# EAGLE design Shruthi-Digital-XT-v02 (EAGLE 5.09)

## Sheet 1 of 3
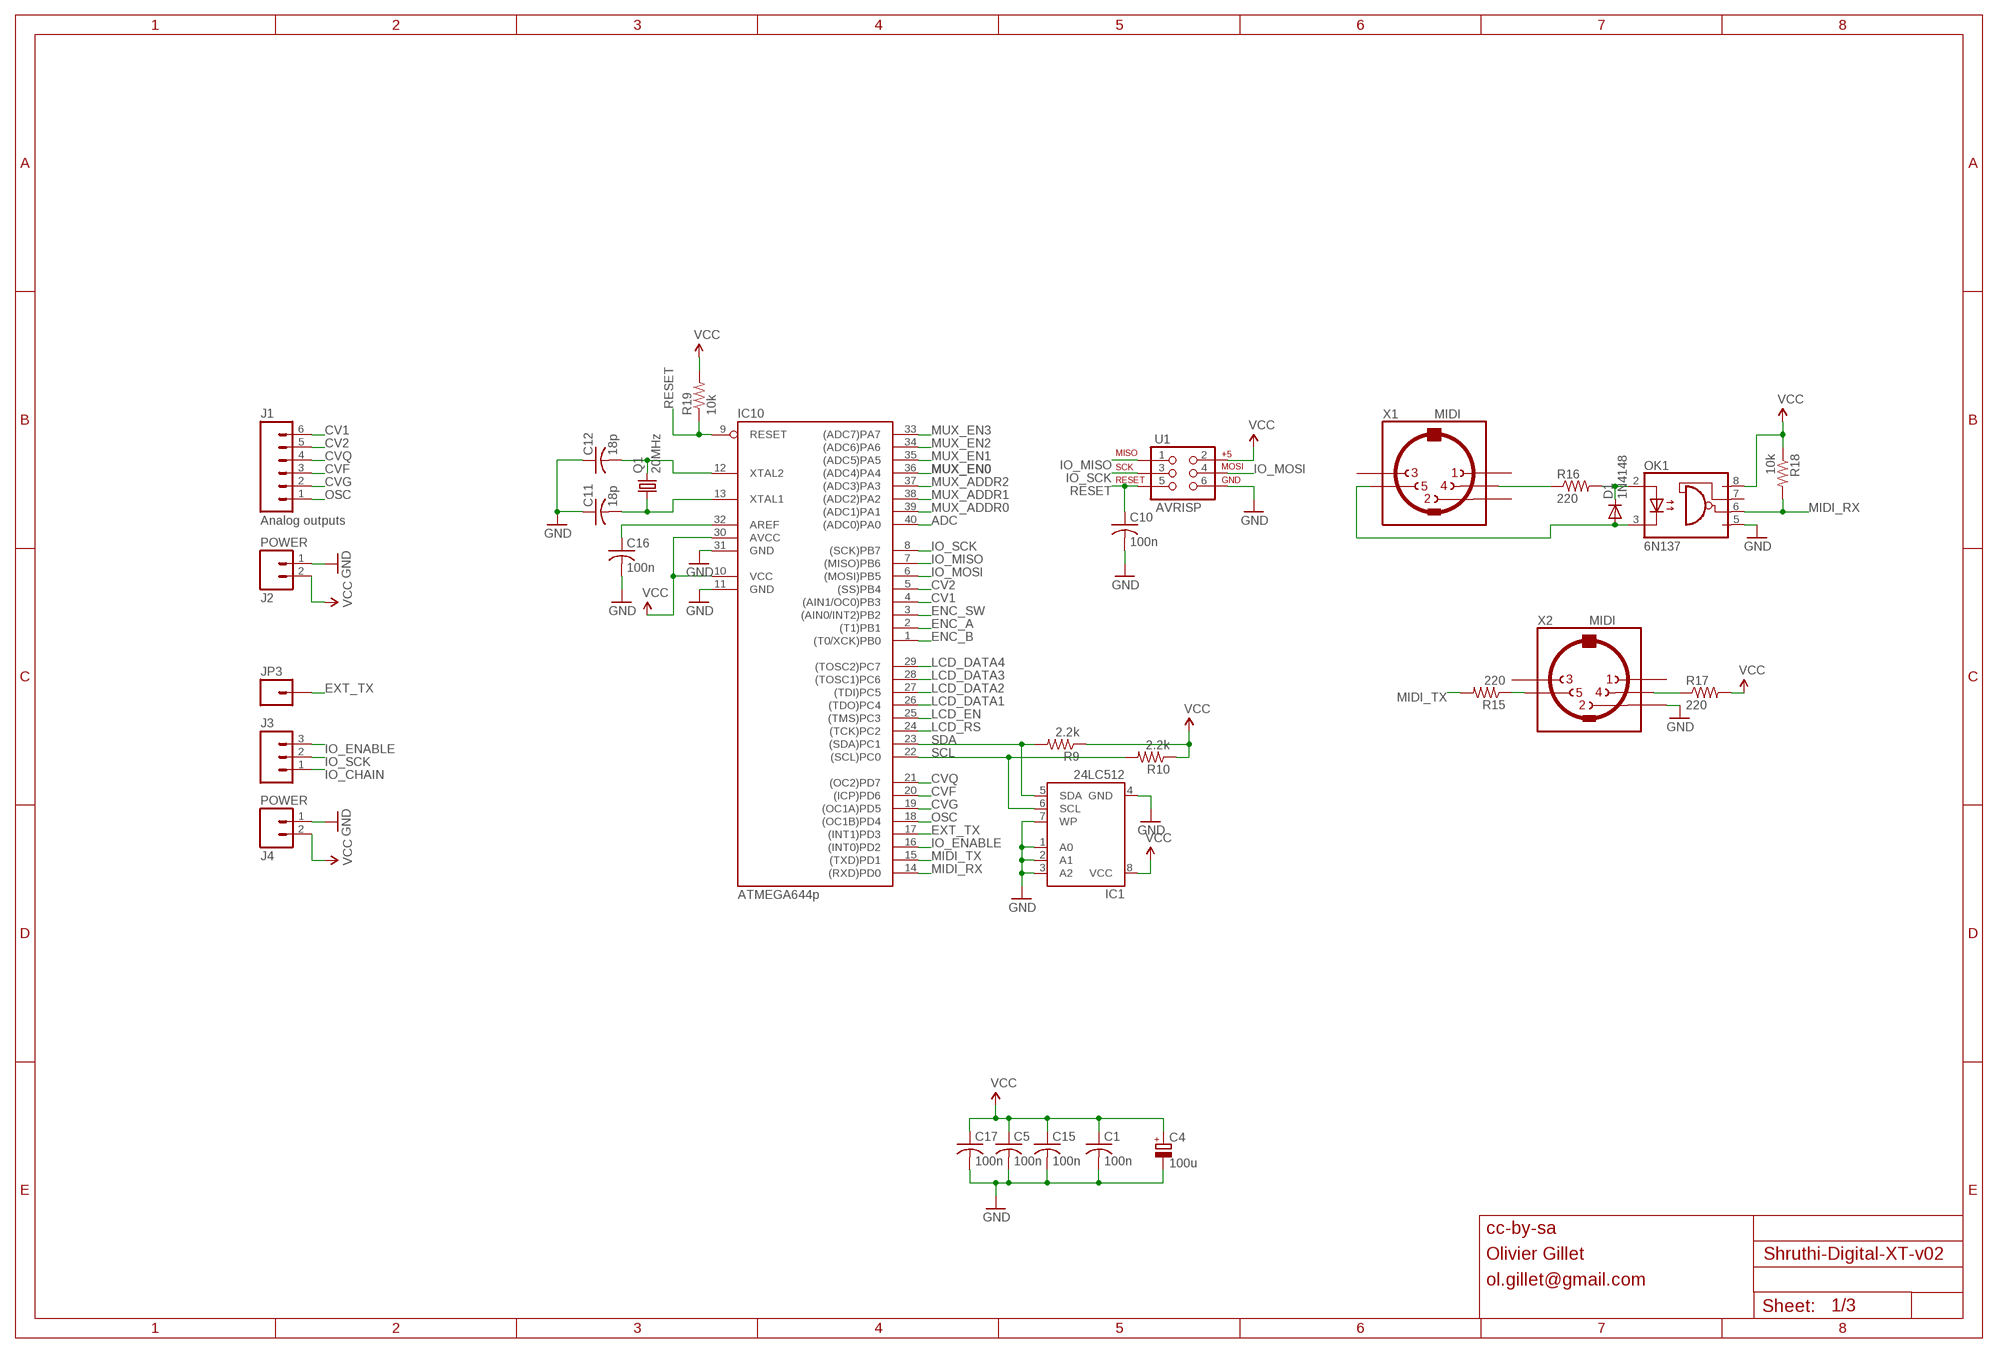
[diagram p0: schematic, sheet 1]

### Parts
C1  100n  C-US025-024X044  [C025-024X044]
C4  100u  CPOL-EUE2.5-7  [E2,5-7]
C5  100n  C-US025-024X044  [C025-024X044]
C10  100n  C-US025-024X044  [C025-024X044]
C11  18p  C-US025-024X044  [C025-024X044]
C12  18p  C-US025-024X044  [C025-024X044]
C15  100n  C-US025-024X044  [C025-024X044]
C16  100n  C-US025-024X044  [C025-024X044]
C17  100n  C-US025-024X044  [C025-024X044]
D1  1N4148  DIODE-D-5  [D-5]
IC1  24LC512  AT24CP  [DIL08]
IC10  ATMEGA644p  MEGA16-P  [DIL40]
J1  M06SIP  [1X06]
J2  POWER  M02PTH  [1X02]
J3  M03PTH  [1X03]
J4  POWER  M02PTH  [1X02]
JP3  M01PTH  [1X01]
OK1  6N137  [DIL08]
Q1  20MHz  CRYSTALHC49U-V  [HC49U-V]
R9  2.2k  R-US_0204/7  [0204/7]
R10  2.2k  R-US_0204/7  [0204/7]
R15  220  R-US_0204/7  [0204/7]
R16  220  R-US_0204/7  [0204/7]
R17  220  R-US_0204/7  [0204/7]
R18  10k  R-US_0204/7  [0204/7]
R19  10k  R-US_0204/7  [0204/7]
U1  AVRISP  AVR_SPI_PRG_6PTH  [2X3]
X1  MIDI  MAB5SH  [MAB5SH]
X2  MIDI  MAB5SH  [MAB5SH]

### Nets
ADC: IC10.40((ADC0)PA0) ; also sheet 2
CV1: IC10.4((AIN1/OC0)PB3) J1.6
CV2: IC10.5((SS)PB4) J1.5
CVF: IC10.20((ICP)PD6) J1.3
CVG: IC10.19((OC1A)PD5) J1.2
CVQ: IC10.21((OC2)PD7) J1.4
ENC_A: IC10.2((T1)PB1) ; also sheet 3
ENC_B: IC10.1((T0/XCK)PB0) ; also sheet 3
ENC_SW: IC10.3((AIN0/INT2)PB2) ; also sheet 3
EXT_TX: IC10.17((INT1)PD3) JP3.1
GND: C1.2 C4.- C5.2 C10.2 C11.1 C12.1 C15.2 C16.2 C17.2 IC1.1(A0) IC1.2(A1) IC1.3(A2) IC1.4(GND) IC1.7(WP) IC10.11(GND) IC10.31(GND) J2.1 J4.1 OK1.5(GND) U1.6 X2.2 ; also sheet 2,3
IO_CHAIN: J3.1 ; also sheet 3
IO_ENABLE: IC10.16((INT0)PD2) J3.3 ; also sheet 3
IO_MISO: IC10.7((MISO)PB6) U1.1 ; also sheet 3
IO_MOSI: IC10.6((MOSI)PB5) U1.4 ; also sheet 3
IO_SCK: IC10.8((SCK)PB7) J3.2 U1.3 ; also sheet 3
LCD_DATA1: IC10.26((TDO)PC4) ; also sheet 3
LCD_DATA2: IC10.27((TDI)PC5) ; also sheet 3
LCD_DATA3: IC10.28((TOSC1)PC6) ; also sheet 3
LCD_DATA4: IC10.29((TOSC2)PC7) ; also sheet 3
LCD_EN: IC10.25((TMS)PC3) ; also sheet 3
LCD_RS: IC10.24((TCK)PC2) ; also sheet 3
MIDI_RX: IC10.14((RXD)PD0) OK1.6(VO) R18.2
MIDI_TX: IC10.15((TXD)PD1) R15.2
MUX_ADDR0: IC10.39((ADC1)PA1) ; also sheet 2
MUX_ADDR1: IC10.38((ADC2)PA2) ; also sheet 2
MUX_ADDR2: IC10.37((ADC3)PA3) ; also sheet 2
MUX_EN0: IC10.36((ADC4)PA4) ; also sheet 2
MUX_EN1: IC10.35((ADC5)PA5) ; also sheet 2
MUX_EN2: IC10.34((ADC6)PA6) ; also sheet 2
MUX_EN3: IC10.33((ADC7)PA7) ; also sheet 2
N$2: R15.1 X2.5
N$7: C16.1 IC10.32(AREF)
N$28: D1.C OK1.2(A) R16.2
N$68: R17.1 X2.4
N$72: R16.1 X1.4
N$73: D1.A OK1.3(C) X1.5
N$82: C11.2 IC10.13(XTAL1) Q1.1
N$83: C12.2 IC10.12(XTAL2) Q1.2
OSC: IC10.18((OC1B)PD4) J1.1
RESET: C10.1 IC10.9(RESET) R19.1 U1.5
SCL: IC1.6(SCL) IC10.22((SCL)PC0) R10.2
SDA: IC1.5(SDA) IC10.23((SDA)PC1) R9.2
VCC: C1.1 C4.+ C5.1 C15.1 C17.1 IC1.8(VCC) IC10.10(VCC) IC10.30(AVCC) J2.2 J4.2 OK1.8(VCC) R9.1 R10.1 R17.2 R18.1 R19.2 U1.2 ; also sheet 2,3
Unconnected: OK1.7(VE) X1.1 X1.2 X1.3 X2.1 X2.3

### Notes on the sheet
- Analog outputs
- cc-by-sa
- Olivier Gillet
- ol.gillet@gmail.com

## Sheet 2 of 3
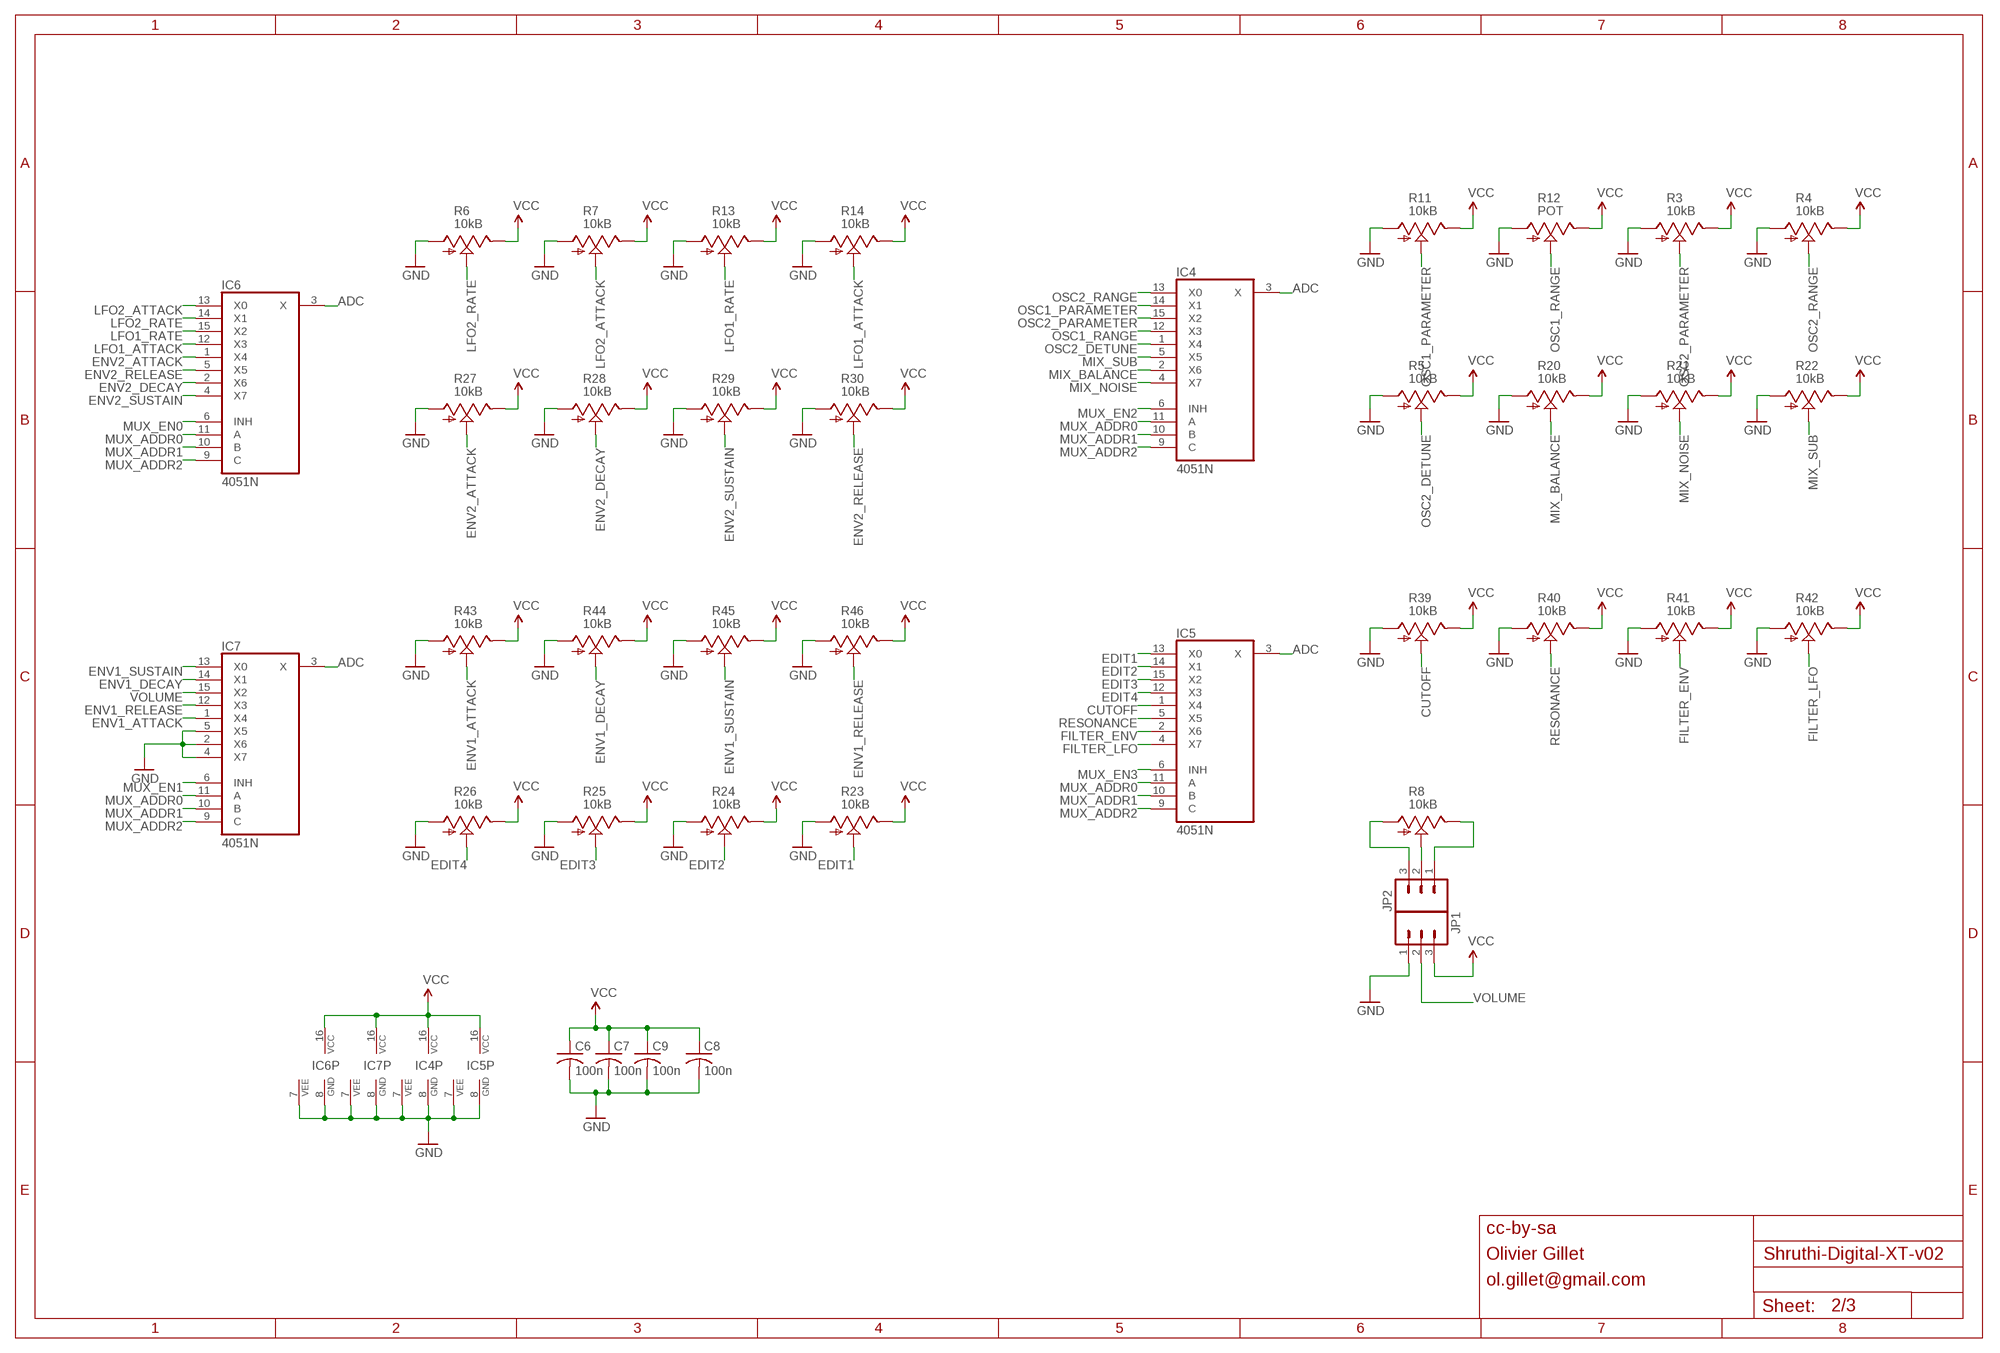
[diagram p1: schematic, sheet 2]

### Parts
C6  100n  C-US025-024X044  [C025-024X044]
C7  100n  C-US025-024X044  [C025-024X044]
C8  100n  C-US025-024X044  [C025-024X044]
C9  100n  C-US025-024X044  [C025-024X044]
IC4  4051N  [DIL16]
IC5  4051N  [DIL16]
IC6  4051N  [DIL16]
IC7  4051N  [DIL16]
JP1  M03PTH  [1X03]
JP2  M03PTH  [1X03]
R3  10kB  POT_USVERTICAL  [ALPS_POT_VERTICAL]
R4  10kB  POT_USVERTICAL  [ALPS_POT_VERTICAL]
R5  10kB  POT_USVERTICAL  [ALPS_POT_VERTICAL]
R6  10kB  POT_USVERTICAL  [ALPS_POT_VERTICAL]
R7  10kB  POT_USVERTICAL  [ALPS_POT_VERTICAL]
R8  10kB  POT_USVERTICAL  [ALPS_POT_VERTICAL]
R11  10kB  POT_USVERTICAL  [ALPS_POT_VERTICAL]
R12  POT  POT_USVERTICAL  [ALPS_POT_VERTICAL]
R13  10kB  POT_USVERTICAL  [ALPS_POT_VERTICAL]
R14  10kB  POT_USVERTICAL  [ALPS_POT_VERTICAL]
R20  10kB  POT_USVERTICAL  [ALPS_POT_VERTICAL]
R21  10kB  POT_USVERTICAL  [ALPS_POT_VERTICAL]
R22  10kB  POT_USVERTICAL  [ALPS_POT_VERTICAL]
R23  10kB  POT_USVERTICAL  [ALPS_POT_VERTICAL]
R24  10kB  POT_USVERTICAL  [ALPS_POT_VERTICAL]
R25  10kB  POT_USVERTICAL  [ALPS_POT_VERTICAL]
R26  10kB  POT_USVERTICAL  [ALPS_POT_VERTICAL]
R27  10kB  POT_USVERTICAL  [ALPS_POT_VERTICAL]
R28  10kB  POT_USVERTICAL  [ALPS_POT_VERTICAL]
R29  10kB  POT_USVERTICAL  [ALPS_POT_VERTICAL]
R30  10kB  POT_USVERTICAL  [ALPS_POT_VERTICAL]
R39  10kB  POT_USVERTICAL  [ALPS_POT_VERTICAL]
R40  10kB  POT_USVERTICAL  [ALPS_POT_VERTICAL]
R41  10kB  POT_USVERTICAL  [ALPS_POT_VERTICAL]
R42  10kB  POT_USVERTICAL  [ALPS_POT_VERTICAL]
R43  10kB  POT_USVERTICAL  [ALPS_POT_VERTICAL]
R44  10kB  POT_USVERTICAL  [ALPS_POT_VERTICAL]
R45  10kB  POT_USVERTICAL  [ALPS_POT_VERTICAL]
R46  10kB  POT_USVERTICAL  [ALPS_POT_VERTICAL]

### Nets
ADC: IC4.3(X) IC5.3(X) IC6.3(X) IC7.3(X) ; also sheet 1
CUTOFF: IC5.1(X4) R39.P$2(S)
EDIT1: IC5.13(X0) R23.P$2(S)
EDIT2: IC5.14(X1) R24.P$2(S)
EDIT3: IC5.15(X2) R25.P$2(S)
EDIT4: IC5.12(X3) R26.P$2(S)
ENV1_ATTACK: IC7.1(X4) R43.P$2(S)
ENV1_DECAY: IC7.14(X1) R44.P$2(S)
ENV1_RELEASE: IC7.12(X3) R46.P$2(S)
ENV1_SUSTAIN: IC7.13(X0) R45.P$2(S)
ENV2_ATTACK: IC6.1(X4) R27.P$2(S)
ENV2_DECAY: IC6.2(X6) R28.P$2(S)
ENV2_RELEASE: IC6.5(X5) R30.P$2(S)
ENV2_SUSTAIN: IC6.4(X7) R29.P$2(S)
FILTER_ENV: IC5.2(X6) R41.P$2(S)
FILTER_LFO: IC5.4(X7) R42.P$2(S)
GND: C6.2 C7.2 C8.2 C9.2 IC4.7(VEE) IC4.8(GND) IC5.7(VEE) IC5.8(GND) IC6.7(VEE) IC6.8(GND) IC7.2(X6) IC7.4(X7) IC7.5(X5) IC7.7(VEE) IC7.8(GND) JP1.1 R3.P$3(A) R4.P$3(A) R5.P$3(A) R6.P$3(A) R7.P$3(A) R11.P$3(A) R12.P$3(A) R13.P$3(A) R14.P$3(A) R20.P$3(A) R21.P$3(A) R22.P$3(A) R23.P$3(A) R24.P$3(A) R25.P$3(A) R26.P$3(A) R27.P$3(A) R28.P$3(A) R29.P$3(A) R30.P$3(A) R39.P$3(A) R40.P$3(A) R41.P$3(A) R42.P$3(A) R43.P$3(A) R44.P$3(A) R45.P$3(A) R46.P$3(A) ; also sheet 1,3
LFO1_ATTACK: IC6.12(X3) R14.P$2(S)
LFO1_RATE: IC6.15(X2) R13.P$2(S)
LFO2_ATTACK: IC6.13(X0) R7.P$2(S)
LFO2_RATE: IC6.14(X1) R6.P$2(S)
MIX_BALANCE: IC4.2(X6) R20.P$2(S)
MIX_NOISE: IC4.4(X7) R21.P$2(S)
MIX_SUB: IC4.5(X5) R22.P$2(S)
MUX_ADDR0: IC4.11(A) IC5.11(A) IC6.11(A) IC7.11(A) ; also sheet 1
MUX_ADDR1: IC4.10(B) IC5.10(B) IC6.10(B) IC7.10(B) ; also sheet 1
MUX_ADDR2: IC4.9(C) IC5.9(C) IC6.9(C) IC7.9(C) ; also sheet 1
MUX_EN0: IC6.6(INH) ; also sheet 1
MUX_EN1: IC7.6(INH) ; also sheet 1
MUX_EN2: IC4.6(INH) ; also sheet 1
MUX_EN3: IC5.6(INH) ; also sheet 1
N$6: JP2.3 R8.P$3(A)
N$8: JP2.1 R8.P$1(E)
N$14: JP2.2 R8.P$2(S)
OSC1_PARAMETER: IC4.14(X1) R11.P$2(S)
OSC1_RANGE: IC4.12(X3) R12.P$2(S)
OSC2_DETUNE: IC4.1(X4) R5.P$2(S)
OSC2_PARAMETER: IC4.15(X2) R3.P$2(S)
OSC2_RANGE: IC4.13(X0) R4.P$2(S)
RESONANCE: IC5.5(X5) R40.P$2(S)
VCC: C6.1 C7.1 C8.1 C9.1 IC4.16(VCC) IC5.16(VCC) IC6.16(VCC) IC7.16(VCC) JP1.3 R3.P$1(E) R4.P$1(E) R5.P$1(E) R6.P$1(E) R7.P$1(E) R11.P$1(E) R12.P$1(E) R13.P$1(E) R14.P$1(E) R20.P$1(E) R21.P$1(E) R22.P$1(E) R23.P$1(E) R24.P$1(E) R25.P$1(E) R26.P$1(E) R27.P$1(E) R28.P$1(E) R29.P$1(E) R30.P$1(E) R39.P$1(E) R40.P$1(E) R41.P$1(E) R42.P$1(E) R43.P$1(E) R44.P$1(E) R45.P$1(E) R46.P$1(E) ; also sheet 1,3
VOLUME: IC7.15(X2) JP1.2

### Notes on the sheet
- cc-by-sa
- Olivier Gillet
- ol.gillet@gmail.com

## Sheet 3 of 3
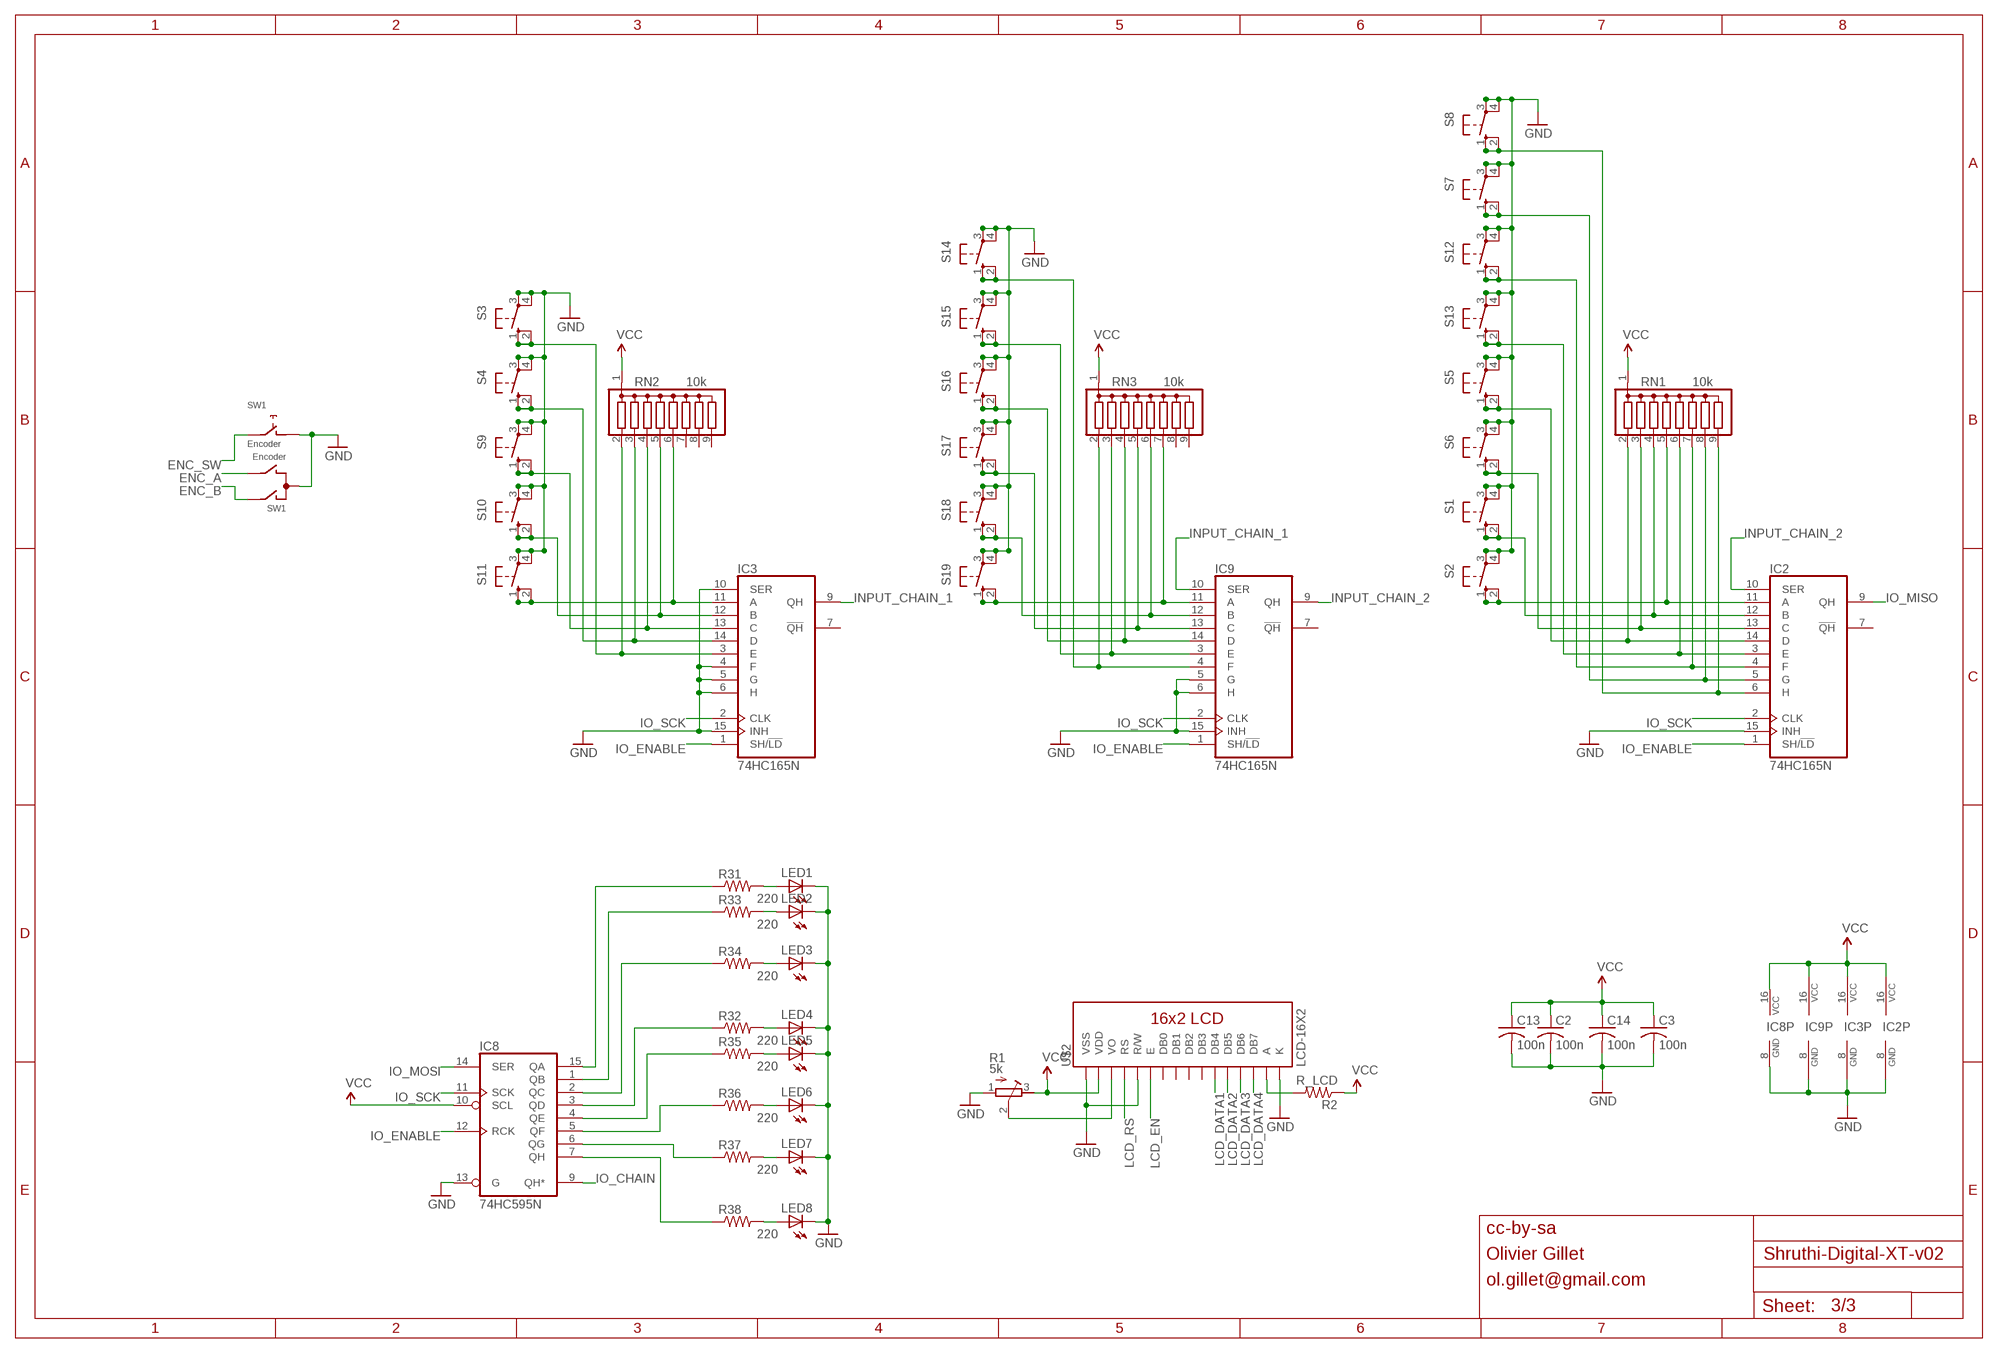
[diagram p2: schematic, sheet 3]

### Parts
C2  100n  C-US025-024X044  [C025-024X044]
C3  100n  C-US025-024X044  [C025-024X044]
C13  100n  C-US025-024X044  [C025-024X044]
C14  100n  C-US025-024X044  [C025-024X044]
IC2  74HC165N  74LS165N  [DIL16]
IC3  74HC165N  74LS165N  [DIL16]
IC8  74HC595N  [DIL16]
IC9  74HC165N  74LS165N  [DIL16]
LED1  LED3MM  [LED3MM]
LED2  LED3MM  [LED3MM]
LED3  LED3MM  [LED3MM]
LED4  LED3MM  [LED3MM]
LED5  LED3MM  [LED3MM]
LED6  LED3MM  [LED3MM]
LED7  LED3MM  [LED3MM]
LED8  LED3MM  [LED3MM]
R1  5k  R-TRIMM3339P  [RTRIM3339P]
R2  R_LCD  R-US_0204/7  [0204/7]
R31  220  R-US_0204/7  [0204/7]
R32  220  R-US_0204/7  [0204/7]
R33  220  R-US_0204/7  [0204/7]
R34  220  R-US_0204/7  [0204/7]
R35  220  R-US_0204/7  [0204/7]
R36  220  R-US_0204/7  [0204/7]
R37  220  R-US_0204/7  [0204/7]
R38  220  R-US_0204/7  [0204/7]
RN1  10k  G08R  [SIL9]
RN2  10k  G08R  [SIL9]
RN3  10k  G08R  [SIL9]
S1  40-XX  [B3F-40XX]
S2  40-XX  [B3F-40XX]
S3  40-XX  [B3F-40XX]
S4  40-XX  [B3F-40XX]
S5  40-XX  [B3F-40XX]
S6  40-XX  [B3F-40XX]
S7  40-XX  [B3F-40XX]
S8  40-XX  [B3F-40XX]
S9  40-XX  [B3F-40XX]
S10  40-XX  [B3F-40XX]
S11  40-XX  [B3F-40XX]
S12  40-XX  [B3F-40XX]
S13  40-XX  [B3F-40XX]
S14  40-XX  [B3F-40XX]
S15  40-XX  [B3F-40XX]
S16  40-XX  [B3F-40XX]
S17  40-XX  [B3F-40XX]
S18  40-XX  [B3F-40XX]
S19  40-XX  [B3F-40XX]
SW1  Encoder  EC12E_SW  [ALPS_EC12E_SW]
U$2  LCD-16X2  [LCD-16X2]

### Nets
ENC_A: SW1.B ; also sheet 1
ENC_B: SW1.A ; also sheet 1
ENC_SW: SW1.E ; also sheet 1
GND: C2.2 C3.2 C13.2 C14.2 IC2.8(GND) IC2.15(INH) IC3.4(F) IC3.5(G) IC3.6(H) IC3.8(GND) IC3.10(SER) IC3.15(INH) IC8.8(GND) IC8.13(G) IC9.5(G) IC9.6(H) IC9.8(GND) IC9.15(INH) LED1.K(C) LED2.K(C) LED3.K(C) LED4.K(C) LED5.K(C) LED6.K(C) LED7.K(C) LED8.K(C) R1.1(E) S1.3(P) S1.4(P1) S2.3(P) S2.4(P1) S3.3(P) S3.4(P1) S4.3(P) S4.4(P1) S5.3(P) S5.4(P1) S6.3(P) S6.4(P1) S7.3(P) S7.4(P1) S8.3(P) S8.4(P1) S9.3(P) S9.4(P1) S10.3(P) S10.4(P1) S11.3(P) S11.4(P1) S12.3(P) S12.4(P1) S13.3(P) S13.4(P1) S14.3(P) S14.4(P1) S15.3(P) S15.4(P1) S16.3(P) S16.4(P1) S17.3(P) S17.4(P1) S18.3(P) S18.4(P1) S19.3(P) S19.4(P1) SW1.C SW1.D U$2.1(VSS) U$2.5(R/W) U$2.16(K) ; also sheet 1,2
INPUT_CHAIN_1: IC3.9(QH) IC9.10(SER)
INPUT_CHAIN_2: IC2.10(SER) IC9.9(QH)
IO_CHAIN: IC8.9(QH*) ; also sheet 1
IO_ENABLE: IC2.1(SH/!LD) IC3.1(SH/!LD) IC8.12(RCK) IC9.1(SH/!LD) ; also sheet 1
IO_MISO: IC2.9(QH) ; also sheet 1
IO_MOSI: IC8.14(SER) ; also sheet 1
IO_SCK: IC2.2(CLK) IC3.2(CLK) IC8.11(SCK) IC9.2(CLK) ; also sheet 1
LCD_DATA1: U$2.11(DB4) ; also sheet 1
LCD_DATA2: U$2.12(DB5) ; also sheet 1
LCD_DATA3: U$2.13(DB6) ; also sheet 1
LCD_DATA4: U$2.14(DB7) ; also sheet 1
LCD_EN: U$2.6(E) ; also sheet 1
LCD_RS: U$2.4(RS) ; also sheet 1
N$1: IC8.2(QC) R34.1
N$3: IC9.11(A) RN3.7 S19.1(S) S19.2(S1)
N$5: IC9.3(E) RN3.3 S15.1(S) S15.2(S1)
N$9: IC2.4(F) RN1.7 S12.1(S) S12.2(S1)
N$10: IC2.14(D) RN1.2 S5.1(S) S5.2(S1)
N$11: IC2.13(C) RN1.3 S6.1(S) S6.2(S1)
N$12: IC2.12(B) RN1.4 S1.1(S) S1.2(S1)
N$13: IC2.11(A) RN1.5 S2.1(S) S2.2(S1)
N$15: IC2.3(E) RN1.6 S13.1(S) S13.2(S1)
N$17: IC2.5(G) RN1.8 S7.1(S) S7.2(S1)
N$24: IC2.6(H) RN1.9 S8.1(S) S8.2(S1)
N$30: IC8.15(QA) R31.1
N$31: IC8.1(QB) R33.1
N$33: IC8.3(QD) R32.1
N$34: IC8.4(QE) R35.1
N$35: IC8.5(QF) R36.1
N$36: IC8.7(QH) R38.1
N$37: IC8.6(QG) R37.1
N$38: IC3.14(D) RN2.3 S4.1(S) S4.2(S1)
N$39: IC3.13(C) RN2.4 S9.1(S) S9.2(S1)
N$40: IC3.12(B) RN2.5 S10.1(S) S10.2(S1)
N$41: IC3.11(A) RN2.6 S11.1(S) S11.2(S1)
N$42: LED1.A R31.2
N$43: LED2.A R33.2
N$44: LED3.A R34.2
N$45: LED4.A R32.2
N$46: LED5.A R35.2
N$47: LED6.A R36.2
N$48: LED7.A R37.2
N$49: LED8.A R38.2
N$50: IC3.3(E) RN2.2 S3.1(S) S3.2(S1)
N$59: IC9.4(F) RN3.2 S14.1(S) S14.2(S1)
N$61: IC9.14(D) RN3.4 S16.1(S) S16.2(S1)
N$62: IC9.13(C) RN3.5 S17.1(S) S17.2(S1)
N$63: IC9.12(B) RN3.6 S18.1(S) S18.2(S1)
N$78: R1.2(S) U$2.3(VO)
N$79: R2.2 U$2.15(A)
VCC: C2.1 C3.1 C13.1 C14.1 IC2.16(VCC) IC3.16(VCC) IC8.10(SCL) IC8.16(VCC) IC9.16(VCC) R1.3(A) R2.1 RN1.1 RN2.1 RN3.1 U$2.2(VDD) ; also sheet 1,2
Unconnected: IC2.7(!QH) IC3.7(!QH) IC9.7(!QH) RN2.7 RN2.8 RN2.9 RN3.8 RN3.9 SW1.GND1(G) SW1.GND2(G) U$2.7(DB0) U$2.8(DB1) U$2.9(DB2) U$2.10(DB3)

### Notes on the sheet
- cc-by-sa
- Olivier Gillet
- ol.gillet@gmail.com

## Library data of the parts
C1-C3 C5-C17 = rcl:C-US: CAPACITOR, American symbol
C4 = rcl:CPOL-EU: POLARIZED CAPACITOR, European symbol
D1 = diode:DIODE-: DIODE
IC1 = atmel:AT24C*: 2-wire serial EEPROM
IC2 IC3 IC9 = 74xx-us:74*165: 8-bit parallel load SHIFT REGISTER
IC4-IC7 = 40xx:4051: 8-channel ANALOG MULTIPLEXER
IC8 = 74xx-eu:74*595: 8-bit SHIFT REGISTER, output latch
IC10 = atmel:MEGA16-P: MICROCONTROLLER 16 Kbytes FLASH 1 kbytes SRAM 512 bytes EEPROM USART 8-channel 10 bit ADC Source: avr.lbr
J1 = SparkFun:M06: Header 6 Standard 6-pin 0.1" header. Use with straight break away headers (SKU : PRT-00116), right angle break away headers (PRT-00553), swiss pins (PRT-00743), machine pins (PRT-00117), and female headers (PRT-00115). Molex polarized connector foot print use with SKU : PRT-08094 with associated crimp pins and housings. NOTES ON THE VARIANTS LOCK and LOCK_LONGPADS... This footprint was designed to help hold the alignment of a through-hole component (i.e. 6-pin header) while soldering it into place. You may notice that each hole has been shifted either up or down by 0.005 of an inch from it's more standard position (which is a perfectly straight line). This slight alteration caused the pins (the squares in the middle) to touch the edges of the holes. Because they are alternating, it causes a "brace" to hold the component in place. 0.005 has proven to be the perfect amount of "off-center" position when using our standard breakaway headers. Although looks a little odd when you look at the bare footprint, once you have a header in there, the alteration is very hard to notice. Also, if you push a header all the way into place, it is covered up entirely on the bottom side. This idea of altering the position of holes to aid alignment will be further integrated into the Sparkfun Library for other footprints. It can help hold any component with 3 or more connection pins.
J2 J4 = SparkFun:M02: Header 2 Standard 2-pin 0.1" header. Use with straight break away headers (SKU : PRT-00116), right angle break away headers (PRT-00553), swiss pins (PRT-00743), machine pins (PRT-00117), and female headers (PRT-00115). Molex polarized connector foot print use with SKU : PRT-08233 with associated crimp pins and housings.
J3 JP1 JP2 = SparkFun:M03: Header 3 Standard 3-pin 0.1" header. Use with straight break away headers (SKU : PRT-00116), right angle break away headers (PRT-00553), swiss pins (PRT-00743), machine pins (PRT-00117), and female headers (PRT-00115). Molex polarized connector foot print use with SKU : PRT-08232 with associated crimp pins and housings.
JP3 = SparkFun:M01: Header 1 Standard 1-pin 0.1" header. Use with straight break away headers (SKU : PRT-00116), right angle break away headers (PRT-00553), swiss pins (PRT-00743), machine pins (PRT-00117), and female headers (PRT-00115).
LED1-LED8 = led:LED: LED OSRAM: - CHIPLED LG R971, LG N971, LY N971, LG Q971, LY Q971, LO R971, LY R971 LH N974, LH R974 LS Q976, LO Q976, LY Q976 LO Q996 - Hyper CHIPLED LW Q18S LB Q993, LB Q99A, LB R99A - SideLED LS A670, LO A670, LY A670, LG A670, LP A670 LB A673, LV A673, LT A673, LW A673 LH A674 LY A675 LS A676, LA A676, LO A676, LY A676, LW A676 LS A679, LY A679, LG A679 - Hyper Micro SIDELED® LS Y876, LA Y876, LO Y876, LY Y876 LT Y87S - SmartLED LW L88C, LW L88S LB L89C, LB L89S, LG L890 LS L89K, LO L89K, LY L89K LS L896, LA L896, LO L896, LY L896 - TOPLED LS T670, LO T670, LY T670, LG T670, LP T670 LSG T670, LSP T670, LSY T670, LOP T670, LYG T670 LG T671, LOG T671, LSG T671 LB T673, LV T673, LT T673, LW T673 LH T674 LS T676, LA T676, LO T676, LY T676, LB T676, LH T676, LSB T676, LW T676 LB T67C, LV T67C, LT T67C, LS T67K, LO T67K, LY T67K, LW E67C LS E67B, LA E67B, LO E67B, LY E67B, LB E67C, LV E67C, LT E67C LW T67C LS T679, LY T679, LG T679 LS T770, LO T770, LY T770, LG T770, LP T770 LB T773, LV T773, LT T773, LW T773 LH T774 LS E675, LA E675, LY E675, LS T675 LS T776, LA T776, LO T776, LY T776, LB T776 LHGB T686 LT T68C, LB T68C - Hyper Mini TOPLED® LB M676 - Mini TOPLED Santana® LG M470 LS M47K, LO M47K, LY M47K Source: http://www.osram.convergy.de LUXEON: - LUMILED® LXK2-PW12-R00, LXK2-PW12-S00, LXK2-PW14-U00, LXK2-PW14-V00 LXK2-PM12-R00, LXK2-PM12-S00, LXK2-PM14-U00 LXK2-PE12-Q00, LXK2-PE12-R00, LXK2-PE12-S00, LXK2-PE14-T00, LXK2-PE14-U00 LXK2-PB12-K00, LXK2-PB12-L00, LXK2-PB12-M00, LXK2-PB14-N00, LXK2-PB14-P00, LXK2-PB14-Q00 LXK2-PR12-L00, LXK2-PR12-M00, LXK2-PR14-Q00, LXK2-PR14-R00 LXK2-PD12-Q00, LXK2-PD12-R00, LXK2-PD12-S00 LXK2-PH12-R00, LXK2-PH12-S00 LXK2-PL12-P00, LXK2-PL12-Q00, LXK2-PL12-R00 Source: www.luxeon.com KINGBRIGHT: KA-3528ASYC Source: www.kingbright.com
OK1 = optocoupler:6N137: MOTOROLA OPTO COUPLER
Q1 = crystal:CRYSTAL: CRYSTAL
R1 = rcl:R-TRIMM: Trimm resistor
R2 R9 R10 R15-R19 R31-R38 = rcl:R-US_: RESISTOR, American symbol
R3-R8 R11-R14 R20-R30 R39-R46 = pot-alps:POT_US
RN1-RN3 = resistor-sil:G08R: SIL RESISTOR
S1-S19 = og-switch:40-XX: OMRON SWITCH
SW1 = switch-alps:EC12E_SW: ALPS rotary Encoder EC12E series with switch
U1 = SparkFun:AVR_SPI_PRG_6: AVR ISP 6 Pin This is the reduced ISP connector for AVR programming. Common on Arduino. This footprint will take up less PCB space and can be used with a 10-pin to 6-pin adapter such as SKU: BOB-08508
U$2 = SparkFun:LCD-16X2
X1 X2 = og-midi:MAB5SH: Female CONNECTOR 5 pins 90 deg. with shield, horizontal (DIN 41524)

## Board
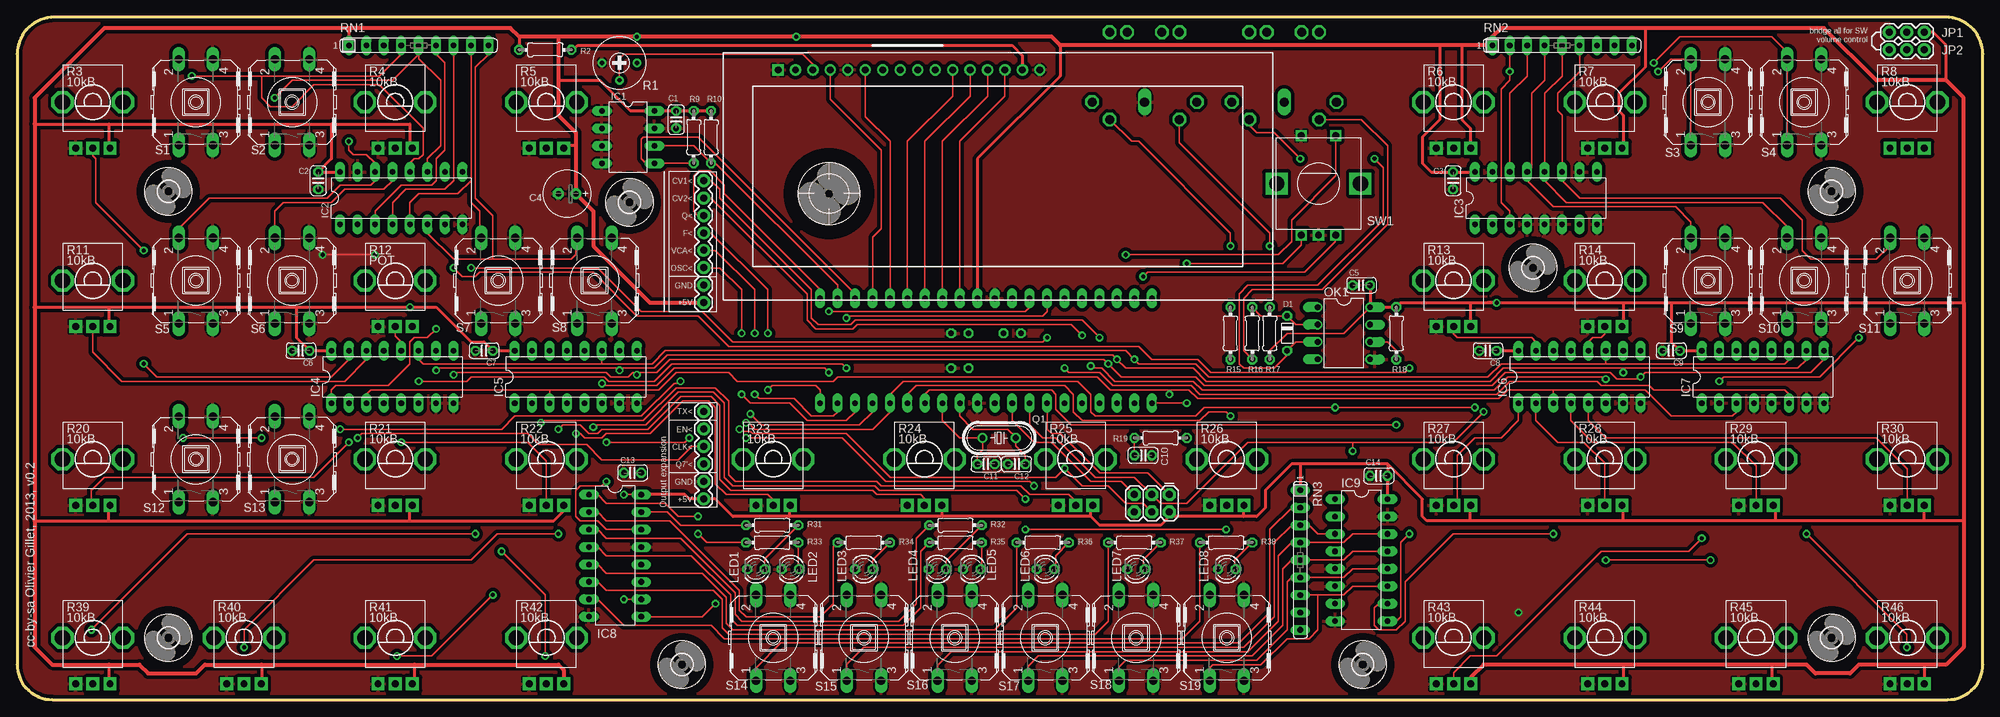
[diagram p3: board, top side]
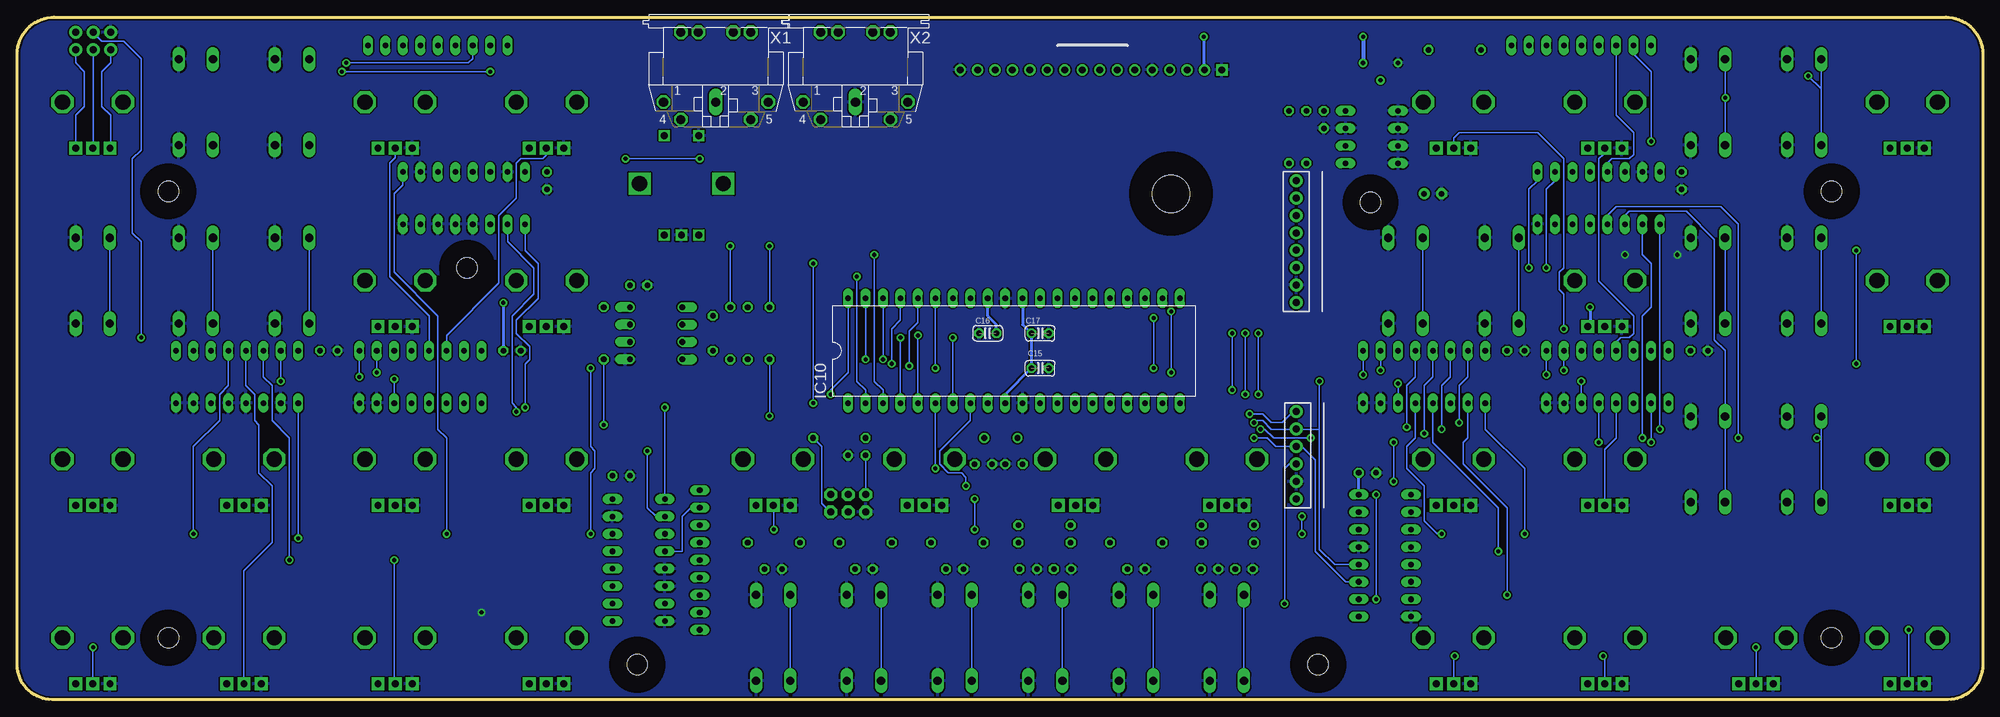
[diagram p4: board, bottom side, seen from below]

Size 286 x 99.36 mm. Coordinates in mm from the lower left corner, seen from the top.
Outline: 280.91,0 arc90 286,5.09 286,93.97 arc90 280.61,99.36 5.38,99.36 arc90 0,93.98 0,5.08 arc90 5.08,0 280.91,0
Copper layers (1*16): Top 0.035mm / dielectric 1.5mm / Bottom 0.035mm
Design rules "SparkFun": minimum track width 8mil, minimum drill 20mil, track to track 8mil, track to pad 8mil, pad to pad 8mil, via to via 8mil, smd to smd 8mil, copper to edge 10mil, drill to drill 8mil, minimum pad ring 12mil, minimum via ring 10mil, stop-mask expansion 4mil, vias tented up to drill 25mil, thermal gap 10mil

### Footprints (pad centres in the part's own frame; a part is rotated, then mirrored left to right if it is on the bottom)
C025-024X044 = drill 0.813 octagon: 1 -1.27,0; 2 1.27,0
E2,5-7 = drill 0.813 pad 1.6 round: + -1.27,0 | drill 0.813 pad 1.6 octagon: - 1.27,0
D-5 = drill 0.813 octagon: A 2.54,0; C -2.54,0
DIL08 = drill 0.813 long: 1 -3.81,-3.81; 2 -1.27,-3.81; 3 1.27,-3.81; 4 3.81,-3.81; 5 3.81,3.81; 6 1.27,3.81; 7 -1.27,3.81; 8 -3.81,3.81
DIL16 = drill 0.813 long: 1 -8.89,-3.81; 2 -6.35,-3.81; 3 -3.81,-3.81; 4 -1.27,-3.81; 5 1.27,-3.81; 6 3.81,-3.81; 7 6.35,-3.81; 8 8.89,-3.81; 9 8.89,3.81; 10 6.35,3.81; 11 3.81,3.81; 12 1.27,3.81; 13 -1.27,3.81; 14 -3.81,3.81; 15 -6.35,3.81; 16 -8.89,3.81
DIL40 = drill 0.813 long: 1 -24.13,-7.62; 2 -21.59,-7.62; 3 -19.05,-7.62; 4 -16.51,-7.62; 5 -13.97,-7.62; 6 -11.43,-7.62; 7 -8.89,-7.62; 8 -6.35,-7.62; 9 -3.81,-7.62; 10 -1.27,-7.62; 11 1.27,-7.62; 12 3.81,-7.62; 13 6.35,-7.62; 14 8.89,-7.62; 15 11.43,-7.62; 16 13.97,-7.62; 17 16.51,-7.62; 18 19.05,-7.62; 19 21.59,-7.62; 20 24.13,-7.62; 21 24.13,7.62; 22 21.59,7.62; 23 19.05,7.62; 24 16.51,7.62; 25 13.97,7.62; 26 11.43,7.62; 27 8.89,7.62; 28 6.35,7.62; 29 3.81,7.62; 30 1.27,7.62; 31 -1.27,7.62; 32 -3.81,7.62; 33 -6.35,7.62; 34 -8.89,7.62; 35 -11.43,7.62; 36 -13.97,7.62; 37 -16.51,7.62; 38 -19.05,7.62; 39 -21.59,7.62; 40 -24.13,7.62
1X06 = drill 1.016 pad 1.88 round: 1 0,0; 2 2.54,0; 3 5.08,0; 4 7.62,0; 5 10.16,0; 6 12.7,0
1X02 = drill 1.016 pad 1.88 round: 1 0,0; 2 2.54,0
1X03 = drill 1.016 pad 1.88 round: 1 0,0; 2 2.54,0; 3 5.08,0
1X01 = drill 1.016 pad 1.88 round: 1 0,0
LED3MM = drill 0.813 octagon: A -1.27,0; K 1.27,0
DIL08' = drill 0.813 offset: 1 -3.81,-3.81; 2 -1.27,-3.81; 3 1.27,-3.81; 4 3.81,-3.81; 5 3.81,3.81; 6 1.27,3.81; 7 -1.27,3.81; 8 -3.81,3.81
HC49U-V = drill 0.813 round: 1 -2.413,0; 2 2.413,0
RTRIM3339P = drill 0.61 round: 1 -2.54,0; 2 0,-2.54; 3 2.54,0
0204/7 = drill 0.813 octagon: 1 -3.81,0; 2 3.81,0
ALPS_POT_VERTICAL = drill 1 pad 1.88 square: P$1 -2.5,6.7; P$2 0,6.7; P$3 2.5,6.7 | drill 2.2 pad 3.175 octagon: P$4 -4.4,0; P$5 4.4,0
SIL9 = drill 0.813 long: 1 -10.16,0; 2 -7.62,0; 3 -5.08,0; 4 -2.54,0; 5 0,0; 6 2.54,0; 7 5.08,0; 8 7.62,0; 9 10.16,0
B3F-40XX = drill 1.194 long: 1 -6.248,2.489; 2 6.248,2.489; 3 -6.248,-2.489; 4 6.248,-2.489
ALPS_EC12E_SW = drill 1 square: A -2.5,-7.5; B 2.5,-7.5; C 0,-7.5; D -2.5,7; E 2.5,7 | drill 2.2 square: GND1 -6.1,0; GND2 6.1,0
2X3 = drill 1.016 pad 1.88 octagon: 1 0,0; 2 0,2.54; 3 2.54,0; 4 2.54,2.54; 5 5.08,0; 6 5.08,2.54
3,0 = hole 3: 0,0
LCD-16X2 = drill 1.016 square: 1 -32,15.5 | drill 1.016 round: 2 -29.46,15.5; 3 -26.92,15.5; 4 -24.38,15.5; 5 -21.84,15.5; 6 -19.3,15.5; 7 -16.76,15.5; 8 -14.22,15.5; 9 -11.68,15.5; 10 -9.14,15.5; 11 -6.6,15.5; 12 -4.06,15.5; 13 -1.52,15.5; 14 1.02,15.5; 15 3.56,15.5; 16 6.1,15.5
5,5 = hole 5.5: 0,0
MAB5SH = drill 1.321 octagon: 1 7.62,7.62; 3 -7.62,7.62; 4 5.08,10.16; 5 -5.08,10.16; P$1 -5.08,-2.54; P$2 -2.54,-2.54; P$3 2.54,-2.54; P$4 5.08,-2.54 | drill 1.321 long: 2 0,7.62

### Placement (x,y rotation side)
C1  95.89,84.45 270 top
C2  43.81,75.56 270 top
C3  208.91,75.56 270 top
C4  80.01,73.66 180 top
C5  195.58,60.33 180 top
C6  41.27,50.8 180 top
C7  67.94,50.8 180 top
C8  214,50.8 180 top
C9  240.66,50.8 180 top
C10  163.83,35.56 0 top
C11  140.97,34.29 180 top
C12  145.41,34.29 0 top
C13  89.53,33.02 180 top
C14  198.1,32.58 180 top
C15  137.16,48.26 0 bottom
C16  144.78,53.34 180 bottom
C17  137.16,53.34 0 bottom
D1  184.78,53.34 270 top
IC1  88.9,81.92 270 top
IC2  55.88,73.03 0 top
IC3  220.98,73.03 0 top
IC4  54.61,46.99 0 top
IC5  81.28,46.99 0 top
IC6  227.33,46.99 0 top
IC7  254,46.99 0 top
IC8  87,20.95 270 top
IC9  195.58,20.32 270 top
IC10  140.97,50.8 0 bottom
J1  99.89,62.88 90 top
J2  99.89,60.34 270 top
J3  99.89,34.3 90 top
J4  99.89,31.77 270 top
JP1  272.42,97.16 0 top
JP2  277.5,94.61 180 top
JP3  99.89,41.92 90 top
LED1  107.5,19 180 top
LED2  112.5,19 180 top
LED3  123.2,19 180 top
LED4  133.9,19 180 top
LED5  138.9,19 180 top
LED6  149.6,19 180 top
LED7  162.8,19 180 top
LED8  176,19 180 top
OK1  6N137  [DIL08']  193.04,53.34 270 top
Q1  142.88,38.1 0 top
R1  87.63,92.71 0 top
R2  76.83,94.61 0 top
R3  11,87 180 top
R4  55,87 180 top
R5  77,87 180 top
R6  209,87 180 top
R7  231,87 180 top
R8  275,87 180 top
R9  98.42,81.92 270 top
R10  100.97,81.92 270 top
R11  11,61 180 top
R12  55,61 180 top
R13  209,61 180 top
R14  231,61 180 top
R15  176.53,53.34 270 top
R16  179.71,53.34 90 top
R17  182.25,53.34 270 top
R18  200.66,53.34 270 top
R19  166.37,38.1 0 top
R20  11,35 180 top
R21  55,35 180 top
R22  77,35 180 top
R23  110,35 180 top
R24  132,35 180 top
R25  154,35 180 top
R26  176,35 180 top
R27  209,35 180 top
R28  231,35 180 top
R29  253,35 180 top
R30  275,35 180 top
R31  109.86,25.4 0 top
R32  136.53,25.4 0 top
R33  109.86,22.86 0 top
R34  123.19,22.86 0 top
R35  136.53,22.86 0 top
R36  149.22,22.86 0 top
R37  162.56,22.86 0 top
R38  175.9,22.86 0 top
R39  11,9 180 top
R40  33,9 180 top
R41  55,9 180 top
R42  77,9 180 top
R43  209,9 180 top
R44  231,9 180 top
R45  253,9 180 top
R46  275,9 180 top
RN1  58.42,95.25 0 top
RN2  224.79,95.25 0 top
RN3  186.69,20.32 270 top
S1  26,87 90 top
S2  40,87 90 top
S3  246,87 90 top
S4  260,87 90 top
S5  26,61 90 top
S6  40,61 90 top
S7  70,61 90 top
S8  84,61 90 top
S9  246,61 90 top
S10  260,61 90 top
S11  275,61 90 top
S12  26,35 90 top
S13  40,35 90 top
S14  110,9 90 top
S15  123.2,9 90 top
S16  136.4,9 90 top
S17  149.6,9 90 top
S18  162.8,9 90 top
S19  176,9 90 top
SW1  189.34,75.14 0 top
U1  167.64,29.84 180 top
U$1  [3,0]  89.09,72.41 0 top
U$2  142.71,76.18 0 top
U$3  [3,0]  22,74 0 top
U$4  [3,0]  264,74 0 top
U$5  [V2_LOGO_SHRUTHI_DIGITAL]  212.1,14.41 0 top
U$6  [3,0]  96.72,5.09 0 top
U$7  [3,0]  22,9 0 top
U$8  [3,0]  264,9 0 top
U$9  [V2_LOGO_DINGBAT1]  57.78,15.88 0 top
U$10  [3,0]  220.54,62.88 0 top
U$11  [3,0]  195.78,5.09 0 top
U$12  [5,5]  118.11,73.66 0 top
X1  184.34,94.63 180 bottom
X2  164.03,94.63 180 bottom

### Tracks (layer width: path | path; a pad name or v marks a point on that pad's centre or on a via)
ADC  (via drill 0.6)
  Top 0.254: 223.52,45.09 IC6.3 | 223.52,45.09 236.85,45.09 240.66,41.27 249.56,41.27 250.19,41.91 IC7.3 | 223.52,45.09 216.85,45.09 215.58,43.81 171.77,43.81 170.5,45.09 167.64,45.09 | 167.64,45.09 159.07,45.09 157.16,46.99 119.38,46.99 118.75,46.35 104.78,46.35 103.5,47.62 95.89,47.62 93.34,45.09 77.47,45.09 | 77.47,45.09 51.44,45.09 50.8,44.45 IC4.3 | 77.47,45.09 IC5.3 | 167.64,45.09 v167.64,44.45
  Bottom 0.254: IC10.40 165.1,47.62 167.64,45.09 v167.64,44.45
CUTOFF  (via drill 0.6)
  Top 0.254: v10.79,10.16 15.24,14.61 24.77,24.13 v66.67,24.13
  Bottom 0.254: R39.P$2 10.79,2.5 v10.79,10.16 | v66.67,24.13 66.67,33.66 72.39,39.37 IC5.1
CV1  (via drill 0.6)
  Top 0.254: 99.91,75.56 J1.6 100.95,75.58 102.23,74.3 102.23,73.03 115.57,59.69 115.57,55.56 116.52,54.61 121.28,54.61 121.92,55.24 154.94,55.24 v157.48,52.7
  Bottom 0.254: v157.48,52.7 IC10.4
CV2  (via drill 0.6)
  Top 0.254: v154.94,53.02 153.35,54.61 122.24,54.61 121.6,53.98 116.2,53.98 114.94,55.24 114.94,59.05 100.95,73.04 J1.5
  Bottom 0.254: v154.94,53.02 IC10.5
CVF  (via drill 0.6)
  Top 0.254: J1.3 100.95,67.96 109.22,59.69 v109.22,53.34 | v109.22,45.09 109.86,45.72 116.2,45.72 116.84,45.09 IC10.20
  Bottom 0.254: v109.22,45.09 v109.22,53.34
CVG  (via drill 0.6)
  Top 0.254: J1.2 99.91,65.41 101.6,65.41 107.31,59.69 v107.31,53.34 | IC10.19 119.38,41.91 118.75,41.27 115.57,41.27 113.03,43.81 107.95,43.81 v107.31,44.45
  Bottom 0.254: v107.31,44.45 v107.31,53.34
CVQ
  Top 0.254: J1.4 99.05,70.5 98.42,71.12 98.42,76.2 99.22,76.99 100.81,76.99 102.87,74.93 102.87,73.66 116.84,59.69 IC10.21
EDIT1  (via drill 0.6)
  Top 0.254: v81.28,38.73 81.92,38.73 82.55,38.1 85.09,38.1 85.72,38.73 92.08,38.73 96.84,43.5 100.65,43.5 101.6,42.55 101.6,31.43 103.19,29.84 109.22,29.84 110,29.07 R23.P$2
  Bottom 0.254: IC5.13 80.01,46.99 81.28,45.72 v81.28,38.73
EDIT2  (via drill 0.6)
  Top 0.254: R24.P$2 132.08,28.38 132.08,29.21 131.44,29.84 125.09,29.84 124.46,30.48 103.82,30.48 102.23,32.07 102.23,42.86 100.97,44.13 96.52,44.13 91.76,39.37 85.09,39.37 84.45,38.73 83.19,38.73 81.92,40.01 79.38,40.01 v78.74,39.37
  Bottom 0.254: v78.74,39.37 78.74,45.72 77.47,46.99 IC5.14
EDIT3  (via drill 0.6)
  Top 0.254: R25.P$2 153.67,28.63 153.67,29.21 153.03,29.84 147.32,29.84 146.05,31.11 125.73,31.11 125.09,31.75 104.46,31.75 103.5,32.7 103.5,43.5 101.6,45.4 95.89,45.4 91.12,40.64 76.52,40.64 v76.2,40.32
  Bottom 0.254: v76.2,40.32 76.2,45.72 74.93,46.99 IC5.15
EDIT4  (via drill 0.6)
  Top 0.254: v146.69,24.77 v175.9,24.77 | v146.69,29.21 145.41,30.48 125.41,30.48 124.78,31.11 104.14,31.11 102.87,32.38 102.87,43.18 101.28,44.77 96.2,44.77 91.44,40.01 84.14,40.01 v83.82,39.69
  Bottom 0.254: R26.P$2 175.9,28.2 v175.9,24.77 | v146.69,29.21 v146.69,24.77 | v83.82,39.69 83.82,45.72 82.55,46.99 IC5.12
ENC_A  (via drill 0.6)
  Top 0.254: SW1.B 191.77,67.56 191.77,66.67 187.32,62.23 164.47,62.23 v163.83,61.59
  Bottom 0.254: IC10.2 162.56,45.09 163.83,46.35 v163.83,61.59
ENC_B  (via drill 0.6)
  Top 0.254: SW1.A 186.84,66.19 184.15,63.5 v170.18,63.5 | IC10.1 v170.18,43.18
  Bottom 0.254: v170.18,43.18 v170.18,63.5
ENC_SW  (via drill 0.6)
  Top 0.254: SW1.E 191.84,76.28 185.42,69.85 185.42,66.67 183.51,64.77 v161.29,64.77
  Bottom 0.254: IC10.3 160.02,45.09 161.29,46.35 v161.29,64.77
ENV1_ATTACK  (via drill 0.6)
  Top 0.254: v245.11,23.5 243.21,21.59 230.5,21.59 215.26,6.35 211.46,6.35 209,3.9 R43.P$2
  Bottom 0.254: v245.11,23.5 IC7.1
ENV1_DECAY  (via drill 0.6)
  Top 0.254: v246.38,20.32 v231.14,20.32
  Bottom 0.254: v231.14,20.32 231.14,2.44 | v246.38,20.32 246.38,38.1 248.92,40.64 248.92,45.72 250.19,46.99 IC7.14
  Bottom 0.406: 231.14,2.44 R44.P$2
ENV1_RELEASE  (via drill 0.6)
  Top 0.254: v260.35,24.13 274.95,9.53 v274.95,7.62
  Bottom 0.254: IC7.12 255.27,45.72 256.54,44.45 256.54,40.64 260.35,36.83 v260.35,24.13 | R46.P$2 275,7.58
  Bottom 0.406: 275,7.58 v274.95,7.62
ENV1_SUSTAIN
  Bottom 0.254: IC7.13 252.73,45.72 251.46,44.45 251.46,40.64 250.82,40.01 250.82,33.02 248.92,31.11 248.92,22.86 253,18.78 R45.P$2
ENV2_ATTACK
  Top 0.254: R27.P$2 209.55,28.85 209.55,35.56 212.09,38.1 215.9,38.1 218.44,40.64 IC6.1
ENV2_DECAY
  Top 0.254: IC6.2 220.98,40.64 224.16,37.47 227.97,37.47 231,34.43 R28.P$2
ENV2_RELEASE
  Top 0.254: IC6.5 228.6,40.64 231.14,38.1 250.19,38.1 270.51,38.1 275,33.61 R30.P$2
ENV2_SUSTAIN
  Top 0.254: IC6.4 226.06,40.64 229.24,37.47 249.56,37.47 253,34.02 R29.P$2
EXT_TX  (via drill 0.6)
  Top 0.254: IC10.17 124.46,41.91 122.56,40.01 108.27,40.01 v106.68,41.59
  Bottom 0.254: v106.68,41.59 104.78,41.59 103.5,40.32 101.92,40.32 100.31,41.92 JP3.1
FILTER_ENV  (via drill 0.6)
  Top 0.254: v69.22,15.24 60.33,6.35 v55.24,6.35
  Bottom 0.254: IC5.2 74.93,38.1 75.56,37.47 75.56,34.29 69.22,27.94 v69.22,15.24 | v55.24,6.35 55,6.11 R41.P$2
FILTER_LFO  (via drill 0.6)
  Top 0.254: v70.48,21.59 76.83,15.24 v76.83,6.35
  Bottom 0.254: IC5.4 80.01,37.47 70.48,27.94 v70.48,21.59 | v76.83,6.35 77,6.18 R42.P$2
GND  (via drill 0.6)
  Top 0.254: v44.45,64.77 v52.07,64.77
  other vias: 218.44,12.7
  pour Bottom: -2.54,-2.54 287.02,-2.54 287.02,101.6 -2.54,101.6
  pour Top (isolate 0.508): -2.54,-2.54 287.02,-2.54 287.02,101.6 -2.54,101.6
INPUT_CHAIN_1  (via drill 0.6)
  Top 0.254: v223.52,24.13 208.91,24.13 201.93,17.14 201.93,11.43 200.66,10.16 198.12,10.16 197.49,10.79 197.49,13.34 198.12,13.97 IC9.10
  Bottom 0.254: v223.52,24.13 223.52,38.1 224.79,39.37 224.79,55.88 231.14,62.23 231.14,73.66 229.87,74.93 IC3.9
INPUT_CHAIN_2  (via drill 0.6)
  Top 0.254: v63.5,62.87 64.77,61.59 66.67,61.59 67.31,62.23 83.82,62.23 90.17,55.88 99.06,55.88 103.5,51.44 163.19,51.44 165.1,49.53 171.77,49.53 173.67,47.62 201.93,47.62 v202.56,48.26 | v202.56,24.13 201.29,22.86 201.29,12.06 200.66,11.43 IC9.9
  Bottom 0.254: IC2.10 62.23,75.56 63.5,74.3 v63.5,62.87 | v202.56,48.26 202.56,36.83 201.93,36.2 201.93,33.66 202.56,33.02 v202.56,24.13
IO_CHAIN  (via drill 0.6)
  Top 0.254: v101.6,13.97 99.69,12.06 IC8.9
  Bottom 0.254: J3.1 100.95,34.3 101.6,33.66 v101.6,13.97
IO_ENABLE  (via drill 0.6)
  Top 0.254: v212.09,42.55 v191.77,42.55 172.72,42.55 171.45,41.27 156.84,41.27 156.21,41.91 156.21,44.45 154.31,46.35 128.91,46.35 127,44.45 IC10.16 127,41.91 124.46,39.37 107.31,39.37 106.36,40.32 v106.05,40.32 | v46.99,39.37 70.48,39.37 72.39,41.27 90.81,41.27 95.57,46.04 96.2,46.04 v96.52,46.35
  Bottom 0.254: 99.88,39.37 J3.3 99.91,39.37 | v191.77,42.55 IC9.1 | IC3.1 212.09,65.41 210.19,63.5 210.19,58.42 213.36,55.24 213.36,53.34 211.46,51.44 211.46,49.53 212.09,48.9 v212.09,42.55 | v46.99,39.37 IC2.1 | v106.05,40.32 105.73,40.64 104.78,40.64 103.5,39.37 99.88,39.37 | 96.52,39.37 v96.52,46.35 | 99.88,39.37 96.52,39.37 | 96.52,39.37 96.52,21.91 94.3,19.68 IC8.12
IO_MISO  (via drill 0.6)
  Top 0.254: IC10.7 149.86,39.37 150.5,38.73 151.76,38.73 157.48,33.02 164.47,33.02 U1.1 | v66.04,62.87 84.45,62.87 90.81,56.52 99.69,56.52 104.14,52.07 149.22,52.07 v149.86,52.7
  Bottom 0.254: IC2.9 64.77,75.56 66.04,74.3 v66.04,62.87 | v149.86,52.7 IC10.7
IO_MOSI  (via drill 0.6)
  Top 0.254: U1.4 163.83,28.57 161.29,28.57 158.75,31.11 154.94,31.11 v152.4,33.66 151.13,32.38 127,32.38 120.65,38.73 107,38.73 106.68,39.05 105.73,39.05 105.41,39.37 v105.09,39.37 | IC8.14 85.72,24.77 84.45,26.04 81.92,26.04 81.28,26.67 81.28,30.48 81.92,31.11 85.09,31.11 v85.72,31.75 | v85.72,37.47 97.16,37.47 v97.79,38.1
  Bottom 0.203: v97.79,38.1 103.19,38.1
  Bottom 0.254: v152.4,33.66 IC10.6 | v85.72,31.75 v85.72,37.47 | 103.19,38.1 104.46,39.37 v105.09,39.37
IO_SCK  (via drill 0.6)
  Top 0.254: IC10.8 147.32,40.01 149.22,38.1 151.13,38.1 156.84,32.38 162.56,32.38 U1.3 166.37,28.57 170.18,28.57 179.07,37.47 194.31,37.47 | v147.96,31.11 147.32,31.75 126.36,31.75 120.02,38.1 v106.05,38.1 | v213.36,41.91 208.91,37.47 194.31,37.47 | 98.41,36.84 J3.2 98.12,36.84 96.2,34.92 85.09,34.92 82.87,37.15 75.88,37.15 74.3,38.73 50.16,38.73 v49.53,38.1 | 194.31,37.47 v194.31,36.2
  Bottom 0.254: IC10.8 147.32,40.64 151.76,36.2 151.76,34.29 150.5,33.02 148.59,33.02 147.96,32.38 v147.96,31.11 | IC9.2 193.04,26.67 194.31,27.94 v194.31,36.2 | v213.36,41.91 213.36,42.55 214,43.18 214,55.88 210.82,59.05 210.82,62.87 214.63,66.67 IC3.2 | v49.53,38.1 49.53,55.88 48.26,57.15 48.26,63.5 49.53,64.77 IC2.2 | v106.05,38.1 104.14,38.1 102.87,36.83 99.91,36.83 J3.2 99.08,36.84 97.16,34.92 97.16,21.59 92.71,17.14 IC8.11
LCD_DATA1
  Top 0.254: IC10.26 129.54,81.28 136.1,87.84 U$2.11
LCD_DATA2
  Top 0.254: IC10.27 132.08,81.28 138.65,87.84 U$2.12
LCD_DATA3
  Top 0.254: IC10.28 134.62,81.28 141.19,87.84 U$2.13
LCD_DATA4
  Top 0.254: IC10.29 137.16,81.28 143.72,87.84 U$2.14
LCD_EN
  Top 0.254: IC10.25 127,81.28 123.41,84.88 U$2.6
LCD_RS
  Top 0.254: IC10.24 124.46,63.5 124.46,67.31 125.73,68.58 125.73,80.01 118.33,87.42 U$2.4
LFO1_ATTACK
  Top 0.254: IC6.12 228.6,52.07 229.24,52.7 230.5,52.7 231,53.2 R14.P$2
LFO1_RATE
  Top 0.254: R13.P$2 208.91,54.22 208.91,53.34 209.55,52.7 220.34,52.7 220.98,52.07 IC6.15
LFO2_ATTACK
  Bottom 0.254: IC6.13 226.06,55.88 231.78,61.59 231.78,78.11 231,78.88 R7.P$2
LFO2_RATE
  Bottom 0.254: R6.P$2 209,79.29 209.55,78.74 212.72,78.74 213.36,78.11 213.36,73.03 215.9,70.48 215.9,60.64 223.52,53.02 IC6.14
MIDI_RX  (via drill 0.6)
  Top 0.254: R18.2 200.66,50.8 199.39,52.07 OK1.6 | IC10.14 132.08,44.45 132.72,45.09 150.5,45.09 151.13,44.45 151.13,42.23 153.35,40.01 v200.66,40.01
  Bottom 0.254: v200.66,40.01 R18.2
MIDI_TX  (via drill 0.6)
  Top 0.254: IC10.15 129.54,44.45 130.81,45.72 152.4,45.72 153.67,44.45 153.67,41.91 154.94,40.64 172.09,40.64 173.35,41.91 175.9,41.91 v176.53,41.27
  Bottom 0.254: v176.53,41.27 R15.2
MIX_BALANCE  (via drill 0.6)
  Top 0.254: R20.P$2 10.79,28.5 10.79,30.48 12.7,32.38 43.18,32.38 v48.26,37.47
  Bottom 0.254: v48.26,37.47 IC4.2
MIX_NOISE
  Bottom 0.254: IC4.4 53.34,38.1 55,36.44 R21.P$2
MIX_SUB  (via drill 0.6)
  Top 0.254: R22.P$2 77,34.76 74.3,37.47 59.69,37.47 59.05,37.47 v55.88,37.47
  Bottom 0.254: v55.88,37.47 IC4.5
MUX_ADDR0  (via drill 0.6)
  Top 0.254: 85.09,48.9 IC5.11 | 85.09,48.9 59.05,48.9 58.42,49.53 IC4.11 | IC7.11 257.81,49.53 257.18,48.9 231.14,48.9 | 231.14,48.9 IC6.11 | 231.14,48.9 215.9,48.9 214,46.99 173.35,46.99 171.45,48.9 163.19,48.9 v162.56,49.53 161.29,50.8 94.3,50.8 92.39,48.9 85.09,48.9
  Bottom 0.254: v162.56,49.53 IC10.39
MUX_ADDR1  (via drill 0.6)
  Top 0.254: v60.96,47.94 61.28,48.26 87.63,48.26 | IC7.10 260.35,49.53 259.08,48.26 233.68,48.26 | 233.68,48.26 v233.68,47.62 | 87.63,48.26 v87.63,47.94 | 233.68,48.26 216.22,48.26 214.31,46.35 173.04,46.35 171.13,48.26 161.29,48.26 v160.02,49.53 159.38,50.16 94.61,50.16 92.71,48.26 87.63,48.26
  Bottom 0.254: v60.96,47.94 IC4.10 | v233.68,47.62 IC6.10 | v87.63,47.94 IC5.10 | v160.02,49.53 IC10.38
MUX_ADDR2  (via drill 0.6)
  Top 0.254: v63.5,47.31 63.82,47.62 85.72,47.62 86.36,46.99 88.9,46.99 89.53,47.62 90.17,47.62 | IC7.9 262.89,49.53 260.99,47.62 236.85,47.62 v236.22,46.99 235.9,46.67 232.73,46.67 231.78,47.62 216.53,47.62 214.63,45.72 172.72,45.72 171.45,46.99 160.66,46.99 v158.75,48.9 158.12,49.53 94.93,49.53 93.03,47.62 90.17,47.62 | 90.17,47.62 v90.17,47.31
  Bottom 0.254: v63.5,47.31 IC4.9 | v236.22,46.99 IC6.9 | v90.17,47.31 IC5.9 | IC10.37 157.48,55.24 158.75,53.98 v158.75,48.9
MUX_EN0  (via drill 0.6)
  Top 0.254: v231.14,46.67 230.82,46.99 216.85,46.99 214.95,45.09 172.4,45.09 171.13,46.35 159.7,46.35 157.8,48.26 156.53,48.26 v156.21,48.58
  Bottom 0.254: v231.14,46.67 IC6.6 | v156.21,48.58 156.21,53.66 154.94,54.93 IC10.36
MUX_EN1  (via drill 0.6)
  Top 0.254: IC7.6 257.81,44.45 257.18,45.09 238.12,45.09 237.49,45.72 230.5,45.72 229.87,46.35 217.17,46.35 215.26,44.45 172.09,44.45 170.81,45.72 159.38,45.72 157.48,47.62 153.03,47.62 v152.4,48.26
  Bottom 0.254: v152.4,48.26 IC10.35
MUX_EN2  (via drill 0.6)
  Top 0.254: IC10.34 149.86,56.52 149.22,55.88 120.97,55.88 v120.65,55.56 | v120.65,48.26 120.02,48.9 95.25,48.9 92.71,46.35 86.04,46.35 85.41,46.99 66.04,46.99 65.41,46.35 v58.42,46.35
  Bottom 0.254: v120.65,48.26 v120.65,55.56 | IC4.6 v58.42,46.35
MUX_EN3  (via drill 0.6)
  Top 0.254: IC10.33 147.32,57.15 146.69,56.52 v118.11,56.52 | v118.11,47.62 117.47,48.26 100.97,48.26 100.33,48.26 95.57,48.26 93.03,45.72 85.41,45.72 v85.09,46.04
  Bottom 0.254: v118.11,47.62 v118.11,56.52 | IC5.6 v85.09,46.04
N$1
  Top 0.254: R34.1 118.75,22.23 118.75,13.97 116.84,12.06 106.05,12.06 105.09,13.02 105.09,15.88 94.93,26.04 85.72,26.04 84.45,27.3 IC8.2
N$2  (via drill 0.6)
  Top 0.254: X2.5 162.13,81.28 163.19,81.28 176.53,67.94 v176.53,66.04
  Bottom 0.254: R15.1 v176.53,66.04
N$3
  Top 0.254: IC9.11 194.31,16.51 193.04,15.24 189.23,15.24 | 189.23,15.24 RN3.7 | S19.1 173.51,4.6 173.99,5.08 180.97,5.08 184.78,8.89 187.96,8.89 189.23,10.16 189.23,15.24
  Bottom 0.254: S19.1 S19.2
N$5
  Top 0.254: IC9.3 189.23,24.13 187.96,25.4 RN3.3 185.42,25.4 182.88,22.86 182.88,12.06 178.44,7.62 123.19,7.62 120.71,5.14 S15.1
  Bottom 0.254: S15.1 S15.2
N$6
  Bottom 0.254: R8.P$3 272.42,80.39 272.42,85.09 273.69,86.36 273.69,91.44 272.42,92.71 JP2.3
N$7
  Bottom 0.406: C16.1 143.51,54.61 144.78,55.88 IC10.32
N$8
  Bottom 0.254: R8.P$1 277.5,85.09 276.23,86.36 276.23,91.44 277.5,92.71 JP2.1
N$9  (via drill 0.6)
  Top 0.254: IC2.4 54.61,72.39 56.52,74.3 62.23,74.3 63.5,75.56 RN1.7 | v24.13,38.1 v35.56,38.1
  Bottom 0.254: S12.1 23.51,38.1 | 23.51,38.1 S12.2 | 23.51,38.1 v24.13,38.1 | IC2.4 54.61,70.48 53.34,71.75 38.1,71.75 35.56,69.22 v35.56,38.1
N$10  (via drill 0.6)
  Top 0.254: S5.2 23.5,67.26 23.5,68.58 27.94,73.03 45.09,73.03 46.99,74.93 51.44,74.93 52.07,75.56 IC2.14 52.07,78.11 50.8,79.38 48.9,79.38 48.26,80.01 v48.26,81.28
  Bottom 0.254: S5.1 S5.2 | v48.26,81.28 48.26,91.44 50.8,93.98 RN1.2
N$11
  Top 0.254: S6.2 37.47,67.29 37.47,71.12 38.73,72.39 45.72,72.39 47.62,74.3 53.34,74.3 54.61,75.56 IC2.13
  Bottom 0.254: S6.1 S6.2 | IC2.13 54.61,78.11 53.98,78.74 51.44,78.74 50.8,79.38 50.8,82.55 53.34,85.09 RN1.3
N$12  (via drill 0.6)
  Top 0.254: v25.4,90.81 35.56,90.81 | 35.56,90.81 52.7,90.81 55.88,93.98 RN1.4 | IC2.12 57.15,78.11 57.78,78.74 58.42,78.74 59.05,79.38 59.05,83.19 52.7,89.53 43.18,89.53 40.01,86.36 36.83,86.36 35.56,87.63 35.56,90.81
  Bottom 0.254: v25.4,90.81 23.51,88.92 S1.1 S1.2
N$13  (via drill 0.6)
  Top 0.254: 58.42,93.98 54.61,90.17 40.01,90.17 v37.47,87.63 | IC2.11 59.69,78.74 61.59,80.64 61.59,90.17 58.42,93.34 58.42,93.98 | 58.42,93.98 RN1.5
  Bottom 0.254: S2.1 37.51,87.63 | 37.51,87.63 S2.2 | 37.51,87.63 v37.47,87.63
N$14
  Bottom 0.254: R8.P$2 274.95,80.34 JP2.2
N$15
  Top 0.254: IC2.3 52.07,71.12 55.88,74.93 60.33,74.93 60.96,75.56 60.96,78.74 62.23,80.01 62.23,92.71 60.96,93.98 RN1.6
  Bottom 0.254: S13.1 S13.2 37.47,41.29 37.47,50.8 39.05,52.39 39.05,66.99 43.18,71.12 51.44,71.12 52.07,70.48 IC2.3
N$17
  Top 0.254: 66.04,75.56 66.04,76.2 RN1.8 | 66.04,75.56 64.14,73.66 58.42,73.66 57.15,72.39 IC2.5 | S7.2 67.31,67.45 67.31,71.12 66.04,72.39 66.04,75.56
  Bottom 0.254: S7.1 S7.2
N$24
  Top 0.254: 69.22,64.14 69.22,70.48 66.67,73.03 66.67,92.08 68.58,93.98 RN1.9 | 69.22,64.14 63.5,64.14 59.69,67.94 IC2.6 | S8.2 81.28,67.02 81.28,64.77 80.64,64.14 69.22,64.14
  Bottom 0.254: S8.2 S8.1
N$28
  Top 0.254: OK1.2 186.06,54.61 D1.C 180.97,55.88 R16.2
N$30
  Top 0.254: IC8.15 94.61,27.3 96.52,25.4 R31.1
N$31  (via drill 0.6)
  Top 0.254: IC8.1 84.45,29.84 85.72,28.57 94.3,28.57 96.2,26.67 v99.06,26.67 | v99.06,24.13 100.33,22.86 R33.1
  Bottom 0.254: v99.06,26.67 v99.06,24.13
N$33
  Top 0.254: IC8.3 84.45,24.77 85.72,23.5 96.52,23.5 104.46,15.56 104.46,12.38 105.41,11.43 128.27,11.43 130.81,13.97 130.81,23.5 R32.1
N$34
  Top 0.254: R35.1 131.44,21.59 131.44,13.34 128.91,10.79 104.78,10.79 103.82,11.75 103.82,15.24 98.11,20.95 85.72,20.95 84.45,22.23 IC8.4
N$35
  Top 0.254: IC8.5 84.45,19.68 85.72,18.41 99.69,18.41 103.19,14.92 103.19,11.11 104.14,10.16 142.24,10.16 145.41,13.34 R36.1
N$36
  Top 0.254: IC8.7 84.45,14.61 88.27,10.79 100.97,10.79 102.87,8.89 169.54,8.89 172.09,11.43 R38.1
N$37
  Top 0.254: R37.1 158.75,11.43 156.84,9.53 103.5,9.53 102.55,10.48 102.55,14.61 101.28,15.88 92.08,15.88 90.81,15.88 85.72,15.88 84.45,17.14 IC8.6
N$38  (via drill 0.6)
  Top 0.254: S4.1 S4.2 257.51,94.28 255.27,96.52 241.94,96.52 v238.12,92.71 | IC3.14 217.17,88.27 219.71,90.81 RN2.3
  Bottom 0.254: RN2.3 219.71,93.34 220.34,92.71 v238.12,92.71
N$39
  Top 0.254: S9.2 243.51,69.54 241.3,71.75 223.52,71.75 219.71,75.56 IC3.13 220.34,77.47 220.34,88.27 222.25,90.17 RN2.4
  Bottom 0.254: S9.2 S9.1
N$40
  Top 0.254: S10.2 257.51,68.88 254,72.39 225.43,72.39 222.25,75.56 IC3.12 222.25,88.27 224.79,90.81 RN2.5
  Bottom 0.254: S10.2 S10.1
N$41
  Top 0.254: 272.48,67.25 S11.2 272.51,66.14 270.51,64.14 260.99,64.14 259.71,65.41 259.71,69.85 256.54,73.03 227.33,73.03 224.79,75.56 IC3.11 224.79,85.09 224.16,85.72 224.16,88.27 227.33,91.44 RN2.6
  Bottom 0.254: S11.2 S11.1
N$42
  Top 0.254: R31.2 108.77,20.5 LED1.A
N$43
  Top 0.254: LED2.A 113.67,19.11 R33.2
N$44
  Top 0.254: R34.2 124.47,20.33 LED3.A
N$45
  Top 0.254: R32.2 135.17,20.23 LED4.A
N$46
  Top 0.254: LED5.A 140.34,19.16 R35.2
N$47
  Top 0.254: LED6.A 151.13,19.26 151.13,20.95 R36.2
N$48
  Top 0.254: LED7.A 163.83,19.24 163.83,20.32 R37.2
N$49
  Top 0.254: LED8.A 177.16,19.11 177.16,20.32 R38.2
N$50  (via drill 0.6)
  Top 0.254: IC3.3 217.17,71.12 215.9,72.39 215.9,88.9 217.17,90.17 v217.17,91.44 RN2.2 | S3.1 S3.2 240.57,93.25 v238.76,91.44
  Bottom 0.254: v217.17,91.44 v238.76,91.44
N$59
  Top 0.254: RN3.2 185.42,27.94 182.25,24.77 182.25,12.7 177.8,8.26 111.12,8.26 107.51,4.64 S14.1
  Bottom 0.254: S14.1 S14.2 | IC9.4 189.23,21.59 189.23,26.67 187.96,27.94 RN3.2
N$61
  Top 0.254: IC9.14 194.31,24.13 193.04,22.86 RN3.4 185.42,22.86 183.51,20.95 183.51,11.43 179.07,6.99 135.89,6.99 133.91,5.01 S16.1
  Bottom 0.254: S16.1 S16.2
N$62
  Top 0.254: IC9.13 194.31,21.59 193.04,20.32 RN3.5 185.42,20.32 184.15,19.05 184.15,10.79 179.71,6.35 148.59,6.35 147.11,4.87 S17.1
  Bottom 0.254: S17.1 S17.2
N$63
  Top 0.254: IC9.12 194.31,19.05 193.04,17.78 RN3.6 185.42,17.78 184.78,17.14 184.78,10.16 180.34,5.71 161.29,5.71 160.31,4.74 S18.1
  Bottom 0.254: S18.1 S18.2
N$68  (via drill 0.6)
  Top 0.254: v182.25,66.04 182.25,67.94 169.1,81.08 X2.4
  Bottom 0.254: R17.1 v182.25,66.04
N$72
  Top 0.254: R16.1 178.44,50.8 178.44,58.42 179.71,59.69 189.87,59.69 199.39,69.22 199.39,80.64 195.56,84.47 X1.4
N$73  (via drill 0.6)
  Top 0.254: OK1.3 186.06,52.07 D1.A 184.78,50.16 182.88,48.26 178.44,48.26 177.8,48.9 177.8,59.05 179.07,60.33 189.23,60.33 198.75,69.85 198.75,77.47 v197.49,78.74 | X1.5 179.26,83.62 180.34,82.55 182.88,82.55 v186.69,78.74
  Bottom 0.254: v186.69,78.74 v197.49,78.74
N$78
  Top 0.254: R1.2 87.63,93.34 88.27,93.98 114.3,93.98 115.78,92.5 U$2.3
N$79
  Top 0.406: U$2.15 146.26,93.77 144.78,95.25 81.6,95.25 80.96,94.61 R2.2
N$82
  Top 0.254: IC10.13 134.62,40.64 137.16,38.1 Q1.1 140.46,36.32 139.7,35.56 C11.2
N$83
  Top 0.254: IC10.12 137.16,41.27 139.06,39.37 144.15,39.37 145.29,38.23 Q1.2 145.29,36.96 146.69,35.56 C12.2
OSC  (via drill 0.6)
  Top 0.254: J1.1 99.91,62.87 102.23,62.87 105.41,59.69 v105.41,53.34 | IC10.18 121.92,41.91 120.65,40.64 114.94,40.64 112.39,43.18 106.68,43.18 v105.41,44.45
  Bottom 0.254: v105.41,44.45 v105.41,53.34
OSC1_PARAMETER
  Top 0.254: IC4.14 50.8,49.53 47.62,46.35 15.24,46.35 11,50.59 R11.P$2
OSC1_RANGE
  Top 0.254: IC4.12 55.88,52.07 55,52.95 R12.P$2
OSC2_DETUNE  (via drill 0.6)
  Top 0.254: IC4.1 45.72,45.09 46.35,45.72 53.98,45.72 57.15,48.9 57.15,52.07 57.78,52.7 59.69,52.7 v60.96,53.98
  Bottom 0.254: v60.96,53.98 60.96,59.05 61.59,59.69 61.59,62.23 60.96,62.87 60.96,78.74 64.77,82.55 76.2,82.55 77,81.75 R5.P$2
OSC2_PARAMETER  (via drill 0.6)
  Top 0.254: IC4.15 48.26,49.53 45.72,46.99 20.32,46.99 v18.41,48.9 | v18.41,65.41 11.43,72.39 11.43,78.74 11,79.17 R3.P$2
  Bottom 0.254: v18.41,48.9 v18.41,65.41
OSC2_RANGE
  Bottom 0.254: R4.P$2 55.24,80.06 55.24,79.38 55.88,78.74 55.88,60.96 50.8,55.88 50.8,53.34 51.44,52.7 52.7,52.7 53.34,52.07 IC4.13
RESET
  Top 0.254: IC10.9 144.78,40.64 147.96,37.47 150.5,37.47 156.21,31.75 160.66,31.75 U1.5 | C10.1 R19.1
  Bottom 0.254: U1.5 C10.1
RESONANCE  (via drill 0.6)
  Top 0.254: v78.74,24.13 69.85,24.13 66.04,20.32 43.18,20.32 33.02,10.16 v33.02,7.62
  Bottom 0.254: IC5.5 82.55,38.1 83.82,36.83 83.82,33.66 81.28,31.11 81.28,26.04 79.38,24.13 v78.74,24.13 | v33.02,7.62 33,7.6 R40.P$2
SCL
  Top 0.254: IC1.6 98.42,80.64 R10.2 101.6,78.11 119.38,60.33 IC10.22
SDA
  Top 0.254: R9.2 IC1.5 91.44,78.11 90.81,78.74 90.81,81.6 91.12,81.92 99.06,81.92 121.92,59.05 IC10.23
VCC  (via drill 0.6)
  Top 0.254: v88.27,14.61 IC8.10 | IC8.16 v88.27,29.84 | OK1.8 193.04,53.34 184.78,53.34 182.25,50.8 R17.2 | 167.64,26.67 U1.2
  Top 0.406: C5.1 OK1.8 | OK1.8 196.87,57.16 | R41.P$1 57.78,2.58 57.78,5.08 | R40.P$1 35.56,2.36 35.56,5.08 | R39.P$1 13.34,2.46 13.34,5.08 | R20.P$1 13.34,28.14 13.34,26.04 | 2.54,26.04 13.34,26.04 | R21.P$1 57.15,27.95 57.15,26.04 | 13.34,26.04 57.15,26.04 | R22.P$1 79.38,28.18 79.38,27.3 78.11,26.04 57.15,26.04 | R11.P$1 13.34,54.47 13.34,57.15 | 2.54,57.15 13.34,57.15 | 13.34,57.15 40.64,57.15 | 40.64,57.15 v57.15,57.15 60.96,57.15 66.04,52.07 67.94,52.07 C7.1 IC5.16 | R3.P$1 13.34,80.47 13.34,83.82 | 2.54,83.82 13.34,83.82 | R4.P$1 57.15,80.65 57.15,83.82 45.72,83.82 | 13.34,83.82 45.72,83.82 | R43.P$1 211.46,2.35 | R44.P$1 233.68,2.48 233.68,5.08 | R45.P$1 255.27,2.53 255.27,5.08 | R46.P$1 277.5,5.08 | R30.P$1 277.5,26.04 | 283.21,26.04 277.5,26.04 | R29.P$1 255.91,27.89 255.91,26.04 | 277.5,26.04 255.91,26.04 | R28.P$1 233.68,28.12 233.68,26.04 | 255.91,26.04 233.68,26.04 | R27.P$1 211.46,28.25 211.46,26.04 | 233.68,26.04 211.46,26.04 | R6.P$1 211.46,80.34 211.46,83.19 210.19,84.45 210.19,95.25 | R7.P$1 233.68,80.48 233.68,85.09 233.04,85.72 233.04,88.27 236.85,92.08 236.85,97.79 | 45.72,83.82 45.72,78.74 C2.1 IC2.16 | R23.P$1 112.39,28.2 112.39,26.67 | 178.44,26.67 167.64,26.67 166.37,25.4 157.48,25.4 156.21,26.67 | 156.21,26.67 134.62,26.67 | 134.62,26.67 112.39,26.67 | IC9.16 199.38,29.23 C14.1 199.39,31.32 199.39,34.29 | R26.P$1 178.44,28.23 178.44,26.67 | R25.P$1 156.21,28.01 156.21,26.67 | R24.P$1 134.62,28.18 134.62,26.67 | IC10.30 139.7,78.74 151.76,90.81 151.76,95.25 | R14.P$1 233.68,54.48 233.68,57.79 | C8.1 IC6.16 | 283.21,57.78 247.65,57.78 247.65,57.79 240.66,57.79 | OK1.8 R18.1 201.29,57.78 211.46,57.78
  Top 0.406: IC3.16 C3.1 205.74,76.83 204.47,78.11 204.47,81.92 207.01,84.45 207.01,95.25 | 48.26,97.79 RN1.1 | 40.64,57.15 40.64,52.7 C6.1 IC4.16 | 112.39,26.67 104.14,26.67 101.6,29.21 99.88,29.21 J4.2 97.81,29.23 97.79,29.21 97.16,29.84 IC8.16 | R5.P$1 79.84,80.64 81.28,80.64 | 233.68,57.79 240.66,57.79 | 233.68,57.79 214,57.79 v215.26,57.78 211.46,57.78 | R10.1 R9.1 C1.1 IC1.8 89.22,85.72 84.77,90.17 78.74,90.17 | R13.P$1 211.46,54.34 211.46,57.78 | JP1.3 278.76,97.16 280.67,95.25 280.67,90.17 | IC7.16 C9.1 240.66,52.07 240.66,57.79 | 73.03,96.52 R2.1 | 178.44,26.67 180.34,26.67 181.61,27.94 181.61,30.48 185.42,34.29 186.69,34.29 | 199.39,34.29 186.69,34.29 | 199.39,34.29 204.47,29.21 204.47,26.67 205.1,26.04 211.46,26.04 | 186.69,34.29 RN3.1
  Top 0.61: 78.74,96.52 73.03,96.52 71.75,97.79 48.26,97.79 12.7,97.79 2.54,87.63 2.54,83.82 2.54,57.15 2.54,26.04 2.54,7.62 5.08,5.08 13.34,5.08 17.78,5.08 19.05,3.81 26.04,3.81 27.3,5.08 35.56,5.08 57.78,5.08 78.74,5.08 79.5,4.32 R42.P$1 | 99.88,57.78 J2.2 92.06,57.8 83.82,66.04 83.82,71.12 C4.+ 81.28,80.64 81.28,82.55 78.74,85.09 78.74,90.17 78.74,96.52 | R43.P$1 211.5,3.22 213.36,5.08 233.68,5.08 255.27,5.08 260.35,5.08 261.62,3.81 266.7,3.81 267.97,5.08 277.5,5.08 280.67,5.08 283.21,7.62 283.21,26.04 283.21,57.78 283.21,87.63 280.67,90.17 270.51,90.17 262.89,97.79 236.85,97.79 215.9,97.79 214.63,96.52 RN2.1 210.19,95.25 207.01,95.25 151.76,95.25 150.5,96.52 v113.35,96.52 v90.17,96.52 78.74,96.52
  Bottom 0.254: v88.27,29.84 v88.27,14.61 | U1.2 168.91,28.57 168.91,36.83 R19.2
  Bottom 0.406: IC8.16 C13.1 | IC10.10 142.24,44.45 C15.1 C17.1 139.7,54.61 IC10.30 | R12.P$1 57.15,54.65 v57.15,57.15 | C8.1 v215.26,57.78 v215.26,57.79 | U$2.2 113.35,91.78 v113.35,96.52
  Bottom 0.61: v90.17,96.52 R1.3
VOLUME  (via drill 0.6)
  Top 0.254: v267.97,52.7 262.25,46.99 248.28,46.99 v247.65,46.35
  Bottom 0.254: v247.65,46.35 IC7.15 | JP1.2 273.69,95.89 270.51,95.89 267.97,93.34 267.97,80.01 269.24,78.74 269.24,67.94 267.97,66.67 v267.97,52.7

### Text on the board
tPlace: CV1< | CV2< | Q< | F< | VCA< | OSC< | GND | +5V | TX< | EN< | CLK< | Q7'< | GND | +5V
tNames: bridge all for SW | volume control | Output expansion | cc-by-sa Olivier Gillet, 2013, v0.2